# EAGLE design EEZ PSU post-regulator r4B44 (SS) (EAGLE 6.1)
Assembly variants: Farnell, TME
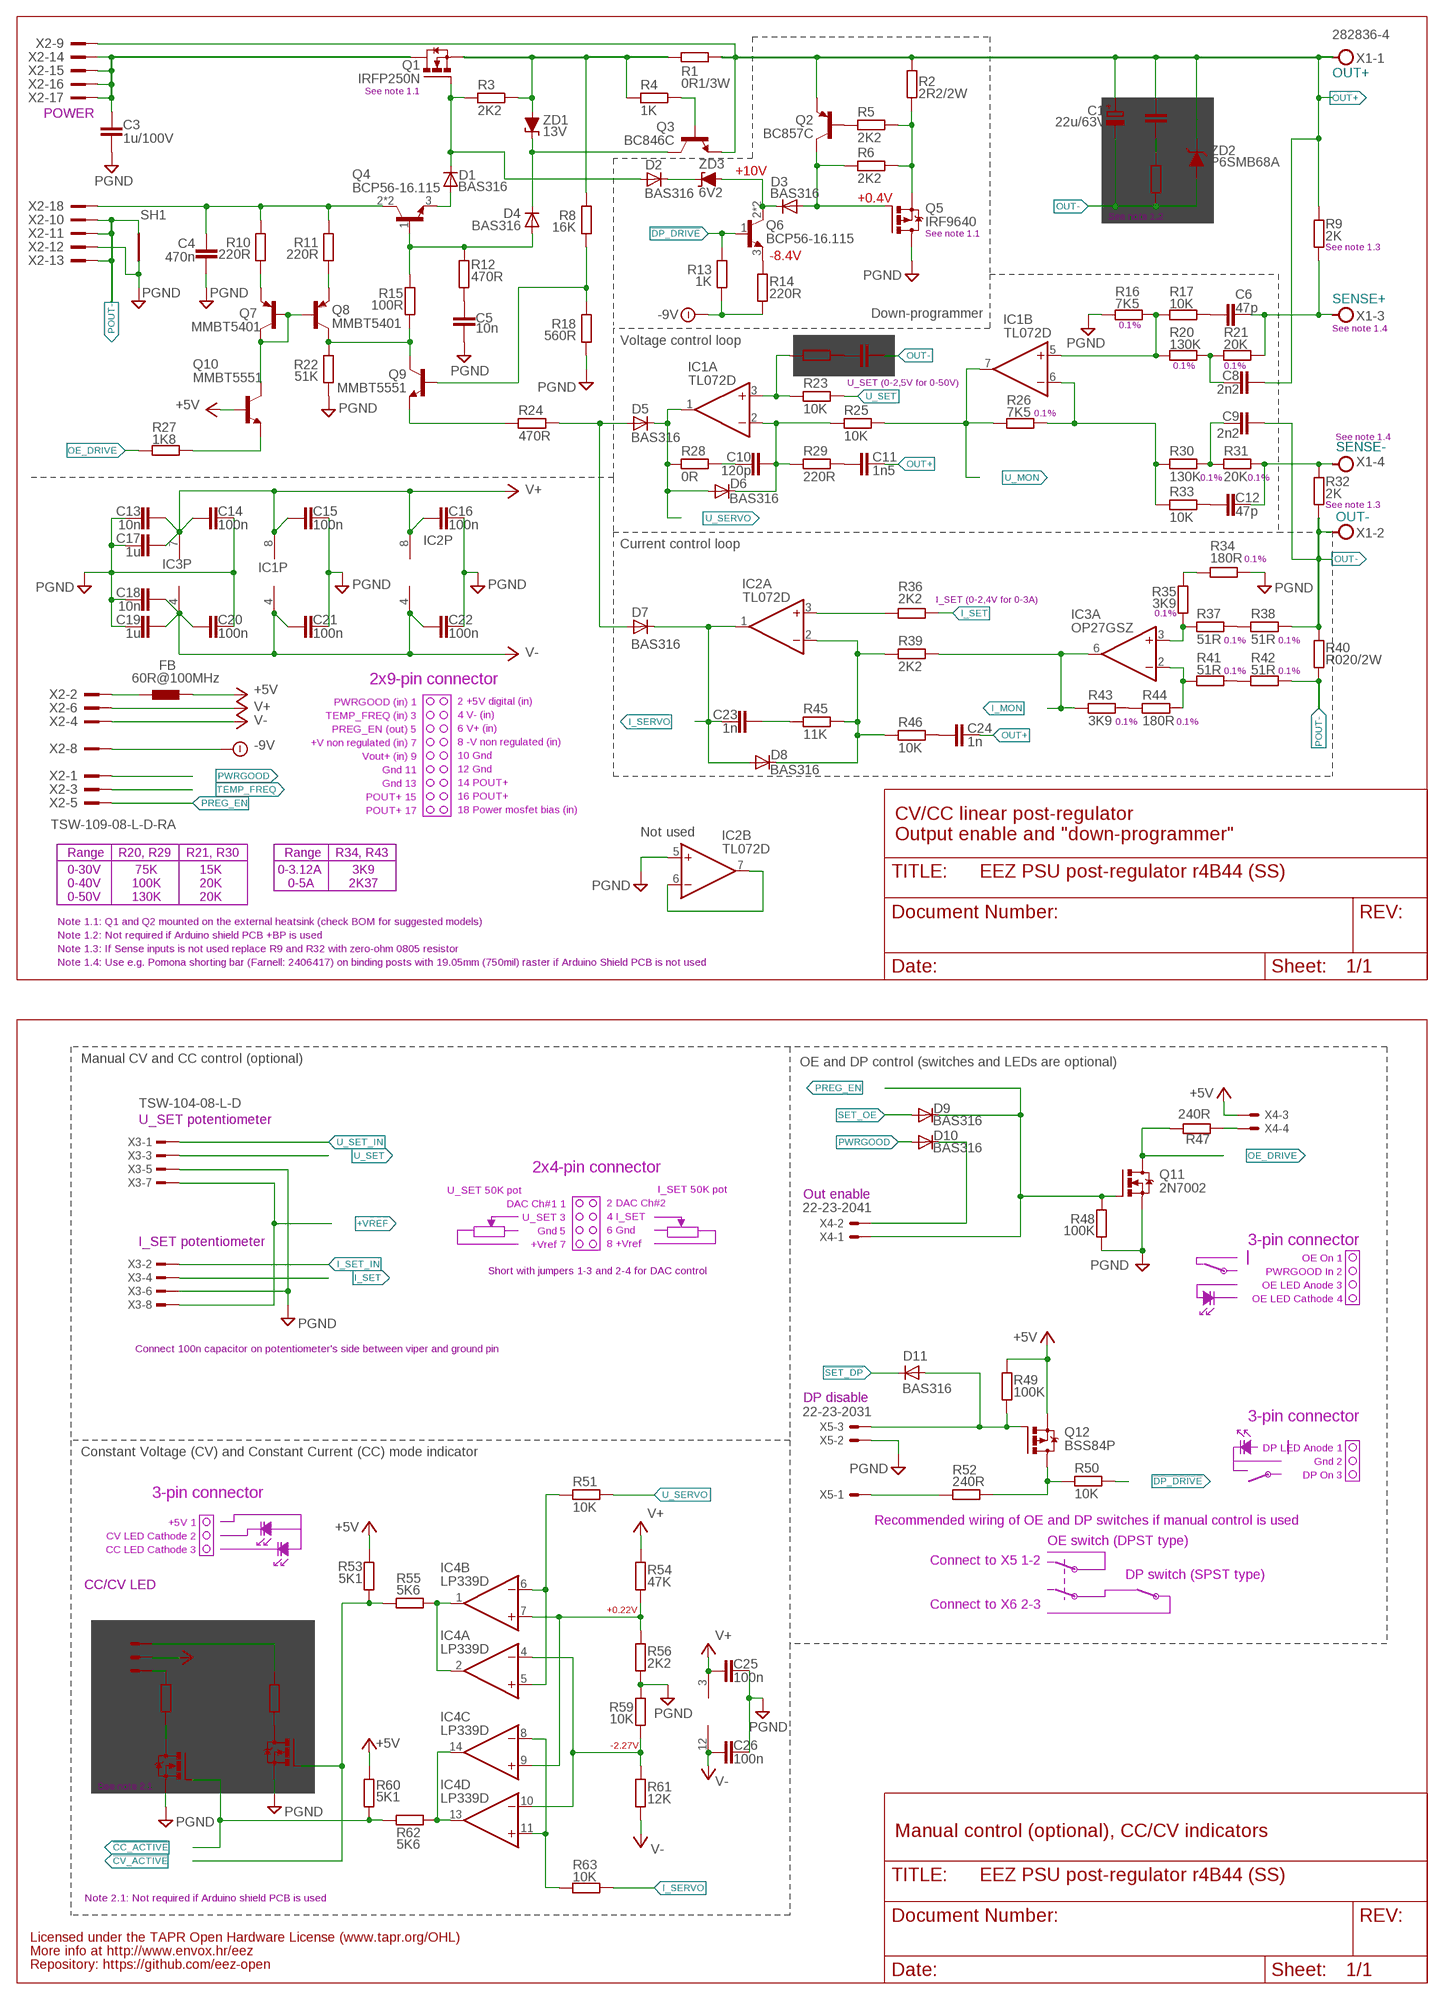
[diagram p0: schematic, sheet 1, part 1 of 2]
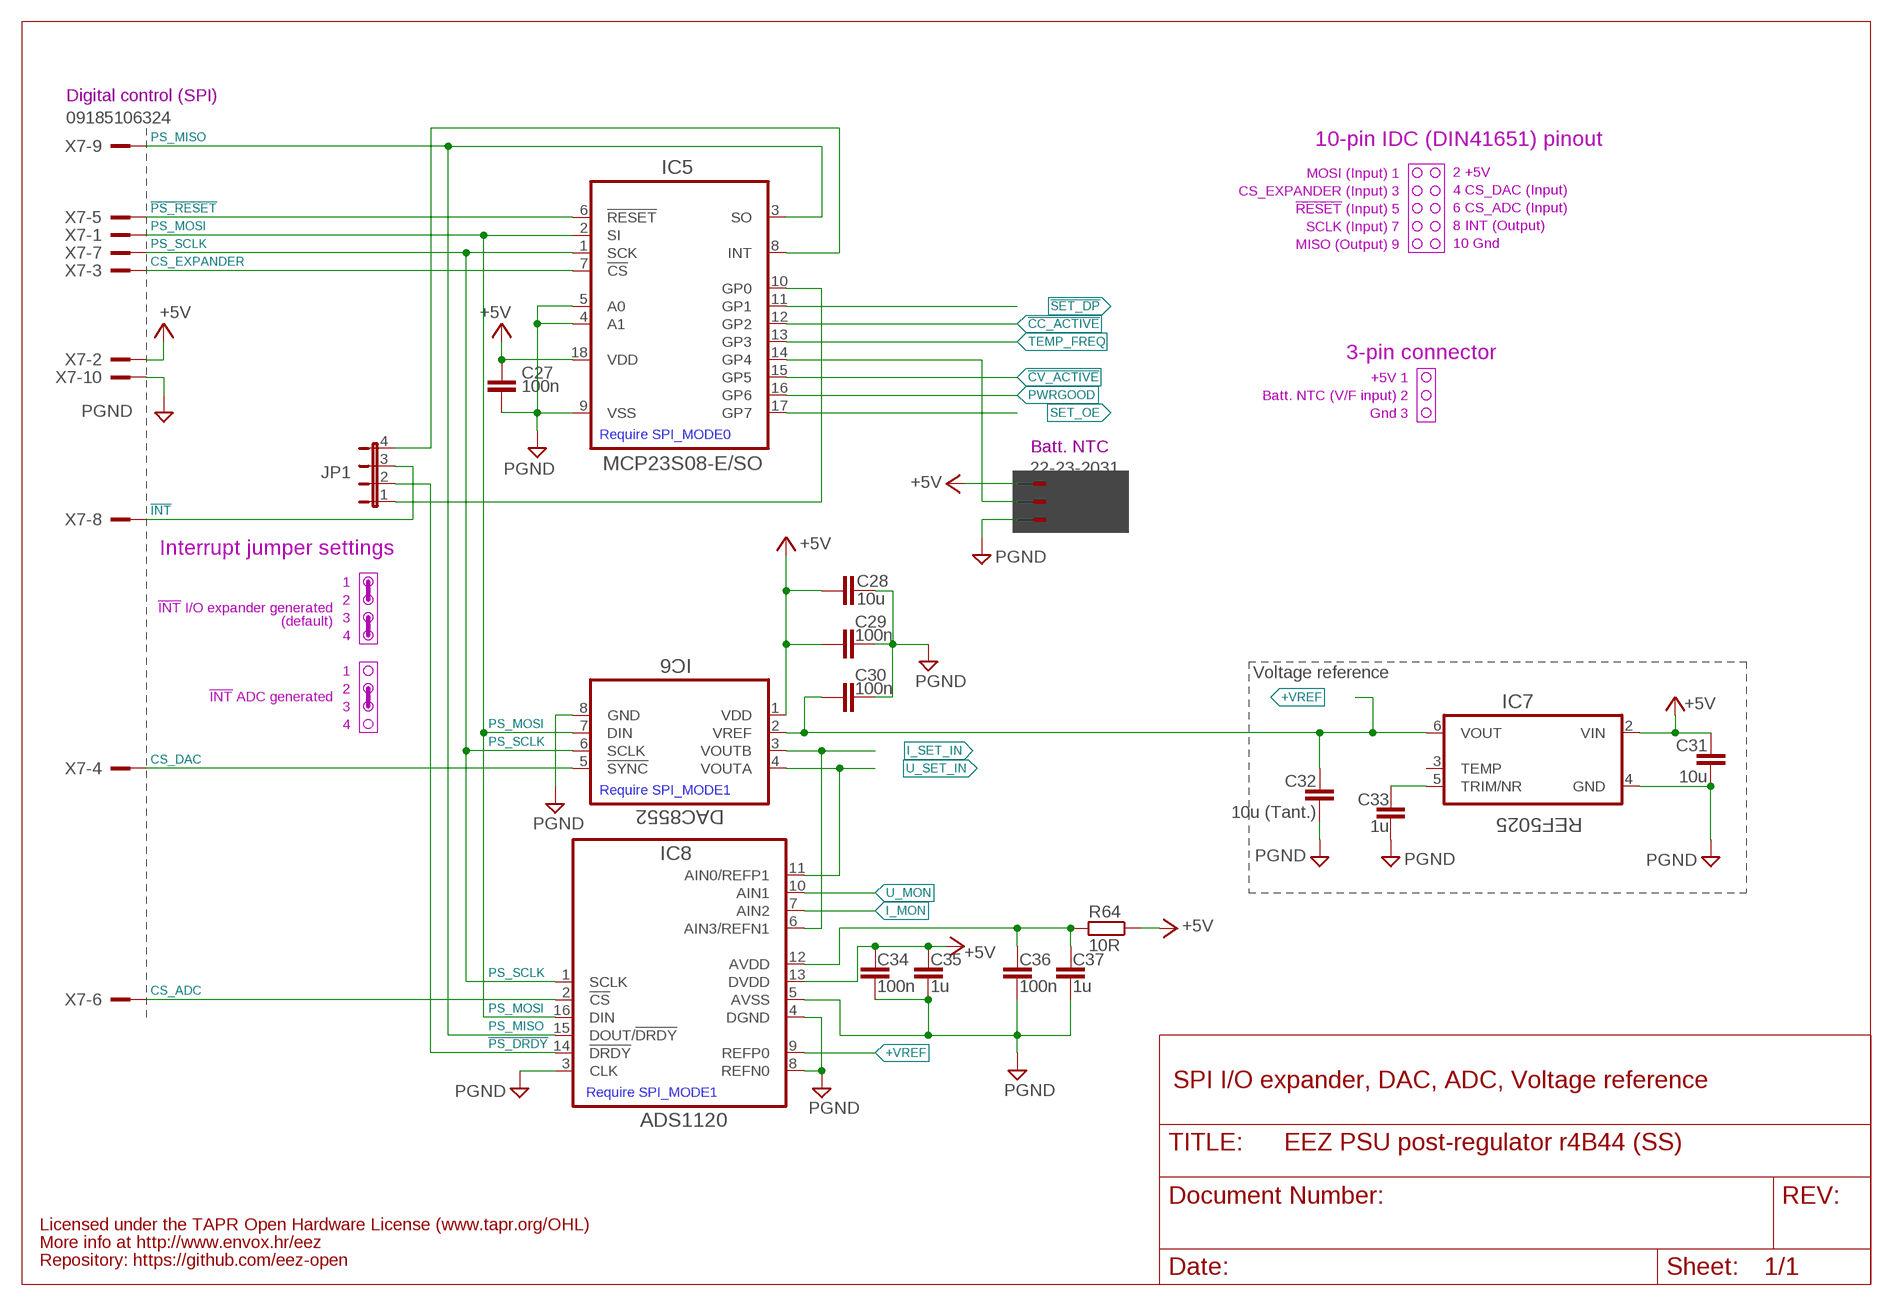
[diagram p1: schematic, sheet 1, part 2 of 2]

## Parts
C1  22u/63V  ECAPEEEFK+2.5MM  [CAPAE660X610N_COMBO2]
C2  470n  C-EUC1812  [C1812]
C3  1u/100V  C-EUC1206  [C1206]
C4  470n  C-EUC1812  [C1812]
C5  10n  C-EUC0805  [C0805]
C6  47p  C-EUC0805  [C0805]
C7  1n5  C-EUC0805  [C0805]
C8  2n2  C-EUC0805  [C0805]
C9  2n2  C-EUC0805  [C0805]
C10  120p  C-EUC0805  [C0805]
C11  1n5  C-EUC0805  [C0805]
C12  47p  C-EUC0805  [C0805]
C13  10n  C-EUC0805  [C0805]
C14  100n  C-EUC0603  [C0603]
C15  100n  C-EUC0603  [C0603]
C16  100n  C-EUC0603  [C0603]
C17  1u  C-EUC0805  [C0805]
C18  10n  C-EUC0805  [C0805]
C19  1u  C-EUC0805  [C0805]
C20  100n  C-EUC0603  [C0603]
C21  100n  C-EUC0603  [C0603]
C22  100n  C-EUC0603  [C0603]
C23  1n  C-EUC0805  [C0805]
C24  1n  C-EUC0805  [C0805]
C25  100n  C-EUC0603  [C0603]
C26  100n  C-EUC0603  [C0603]
C27  100n  C-EUC0603  [C0603]
C28  10u  C-EUC1206  [C1206]
C29  100n  C-EUC0603  [C0603]
C30  100n  C-EUC0603  [C0603]
C31  10u  C-EUC1206  [C1206]
C32  10u (Tant.)  C-EUC1206  [C1206]
C33  1u  C-EUC0805  [C0805]
C34  100n  C-EUC0603  [C0603]
C35  1u  C-EUC0805  [C0805]
C36  100n  C-EUC0603  [C0603]
C37  1u  C-EUC0805  [C0805]
D1  BAS316  DIODE-SOD323-W  [SOD323-W]
D2  BAS316  DIODE-SOD323-W  [SOD323-W]
D3  BAS316  DIODE-SOD323-W  [SOD323-W]
D4  BAS316  DIODE-SOD323-W  [SOD323-W]
D5  BAS316  DIODE-SOD323-W  [SOD323-W]
D6  BAS316  DIODE-SOD323-W  [SOD323-W]
D7  BAS316  DIODE-SOD323-W  [SOD323-W]
D8  BAS316  DIODE-SOD323-W  [SOD323-W]
D9  BAS316  DIODE-SOD323-W  [SOD323-W]
D10  BAS316  DIODE-SOD323-W  [SOD323-W]
D11  BAS316  DIODE-SOD323-W  [SOD323-W]
FB  60R@100MHz  FERRITE_BEAD0603  [BEAD0603]
IC1  TL072D  TL072SOIC8  [SOIC127P600X173-8N]
IC2  TL072D  TL072SOIC8  [SOIC127P600X173-8N]
IC3  OP27GSZ  OP27GSZSO8  [SOIC127P600X173-8N]
IC4  LP339D  LM339D  [SO14]
IC5  MCP23S08-E/SO  MCP23S08  [SOIC127P1030X265-18N]
IC6  DAC8552  DAC8552_DGK_8M  [DGK8-M]
IC7  REF5025  REF50XX  [SOIC127P600X175-8N]
IC8  ADS1120  ADS1120TSSOP-16  [PW(R-PDSO-G16)]
JP1  JP4E  [JP4]
Q1  IRFP250N  IRFP240  [TO247BV]
Q2  BC857C  BC857C-PNP-SOT23-BEC  [SOT23-BEC]
Q3  BC846C  BC846B-NPN-SOT23-BEC  [SOT23-BEC]
Q4  BCP56-16.115  BCP56  [SOT230P700X180-4N]
Q5  IRF9640  [TO220B-VMOS]
Q6  BCP56-16.115  BCP56  [SOT230P700X180-4N]
Q7  MMBT5401  BC857B-PNP-SOT23-BEC  [SOT23-BEC]
Q8  MMBT5401  BC857B-PNP-SOT23-BEC  [SOT23-BEC]
Q9  MMBT5551  MMBT5551LT1-NPN-SOT23-BEC  [SOT23-BEC]
Q10  MMBT5551  MMBT5551LT1-NPN-SOT23-BEC  [SOT23-BEC]
Q11  2N7002  [SOT103P240X110-3N]
Q12  BSS84P  IRLML2246TRPBF  [SOT95P237X112-3N]
Q13  2N7002  [SOT103P240X110-3N]
Q14  2N7002  [SOT103P240X110-3N]
R1  0R1/3W  R-EU_0411/3V  [0411V]
R2  2R2/2W  R-EU_0411/3V  [0411V]
R3  2K2  R-EU_R0805  [R0805]
R4  1K  R-EU_R0805  [R0805]
R5  2K2  R-EU_R0805  [R0805]
R6  2K2  R-EU_R0805  [R0805]
R7  1R  R-EU_R0805  [R0805]
R8  16K  R-EU_R0805  [R0805]
R9  2K  R-EU_R0805  [R0805]
R10  220R  R-EU_R0805  [R0805]
R11  220R  R-EU_R0805  [R0805]
R12  470R  R-EU_R0805  [R0805]
R13  1K  R-EU_R0805  [R0805]
R14  220R  R-EU_R0805  [R0805]
R15  100R  R-EU_R0805  [R0805]
R16  7K5  R-EU_R0805  [R0805]
R17  10K  R-EU_R0805  [R0805]
R18  560R  R-EU_R0805  [R0805]
R19  220R  R-EU_R0805  [R0805]
R20  130K  R-EU_R0805  [R0805]
R21  20K  R-EU_R0805  [R0805]
R22  51K  R-EU_R0805  [R0805]
R23  10K  R-EU_R0805  [R0805]
R24  470R  R-EU_R0805  [R0805]
R25  10K  R-EU_R0805  [R0805]
R26  7K5  R-EU_R0805  [R0805]
R27  1K8  R-EU_R0805  [R0805]
R28  0R  R-EU_R0805  [R0805]
R29  220R  R-EU_R0805  [R0805]
R30  130K  R-EU_R0805  [R0805]
R31  20K  R-EU_R0805  [R0805]
R32  2K  R-EU_R0805  [R0805]
R33  10K  R-EU_R0805  [R0805]
R34  180R  R-EU_R0805  [R0805]
R35  3K9  R-EU_R0805  [R0805]
R36  2K2  R-EU_R0805  [R0805]
R37  51R  R-EU_R0805  [R0805]
R38  51R  R-EU_R0805  [R0805]
R39  2K2  R-EU_R0805  [R0805]
R40  R020/2W  R-EU_R2512  [R2512]
R41  51R  R-EU_R0805  [R0805]
R42  51R  R-EU_R0805  [R0805]
R43  3K9  R-EU_R0805  [R0805]
R44  180R  R-EU_R0805  [R0805]
R45  11K  R-EU_R0805  [R0805]
R46  10K  R-EU_R0805  [R0805]
R47  240R  R-EU_R0805  [R0805]
R48  100K  R-EU_R0805  [R0805]
R49  100K  R-EU_R0805  [R0805]
R50  10K  R-EU_R0805  [R0805]
R51  10K  R-EU_R0805  [R0805]
R52  240R  R-EU_R0805  [R0805]
R53  5K1  R-EU_R0805  [R0805]
R54  47K  R-EU_R0805  [R0805]
R55  5K6  R-EU_R0805  [R0805]
R56  2K2  R-EU_R0805  [R0805]
R57  240R  R-EU_R0805  [R0805]
R58  240R  R-EU_R0805  [R0805]
R59  10K  R-EU_R0805  [R0805]
R60  5K1  R-EU_R0805  [R0805]
R61  12K  R-EU_R0805  [R0805]
R62  5K6  R-EU_R0805  [R0805]
R63  10K  R-EU_R0805  [R0805]
R64  10R  R-EU_R0805  [R0805]
SH1  GND  SHORT  [SHORT]
X1  282836-4  TBLOCK5.0_4A  [TBLOCK5.0_4]
X2  TSW-109-08-L-D-RA  [TSW-109-08-L-D-RA]
X3  TSW-104-08-L-D  TSW-104-02-S-D  [TSW-104-02-S-D]
X4  22-23-2041  [22-23-2041]
X5  22-23-2031  [22-23-2031]
X6  22-23-2031  [22-23-2031]
X7  09185106324  2510-  [PAK100/2500-10]
X8  22-23-2031  [22-23-2031]
ZD1  13V  ZENER-DIODEMINIMELF  [MINIMELF]
ZD2  P6SMB68A  [DO214AA]
ZD3  6V2  ZENER-DIODEMINIMELF  [MINIMELF]

## Nets
!CC_ACTIVE: IC5.12(GP2) Q14.1(G) R60.1 R62.2
!CV_ACTIVE: IC5.15(GP5) Q13.1(G) R53.1 R55.2
!DP_DRIVE: Q6.1(B) R13.1 R50.1
!INT: JP1.3 X7.8
!PS_DRDY: IC8.14(!DRDY) JP1.2
!PS_RESET: IC5.6(!RESET) X7.5
!SET_DP: D11.C IC5.11(GP1)
+5V: C27.1 C28.1 C29.2 C31.1 C34.2 C35.2 FB.P$2 IC5.18(VDD) IC6.1(VDD) IC7.2(VIN) IC8.13(DVDD) Q10.B Q12.2(S) R49.1 R53.2 R60.2 R64.1 X4.3 X6.2 X7.2 X8.1
+VREF: C30.2 C32.1 IC6.2(VREF) IC7.6(VOUT) IC8.9(REFP0) X3.7 X3.8
-9V: R13.2 R14.2 X2.8
BATT_NTC: IC5.14(GP4) X8.2
CC_LED: R57.2 X6.1
CS_ADC: IC8.2(!CS) X7.6
CS_DAC: IC6.5(!SYNC) X7.4
CS_EXPANDER: IC5.7(!CS) X7.3
CV_LED: R58.1 X6.3
DC_IN: C3.1 Q1.D X2.14 X2.15 X2.16 X2.17
DP_LED: Q12.3(D) R50.2 R52.2
GND [gnd]: C3.2 C4.2 C5.2 C13.1 C14.2 C15.1 C16.1 C17.1 C18.1 C19.1 C20.2 C21.1 C22.1 C25.1 C26.1 C27.2 C28.2 C29.1 C30.1 C31.2 C32.2 C33.2 C34.1 C35.1 C36.1 C37.1 IC2.5(B:+IN) IC5.4(A1) IC5.5(A0) IC5.9(VSS) IC6.8(GND) IC7.4(GND) IC8.3(CLK) IC8.4(DGND) IC8.5(AVSS) IC8.8(REFN0) Q5.D Q11.2(S) Q13.2(S) Q14.2(S) R16.1 R18.1 R22.1 R34.1 R48.1 R56.1 R59.2 SH1.1(GND_A) X2.12 X3.5 X3.6 X5.2 X7.10 X8.3 ; supply symbol labelled PGND
I_MON: IC3.6(A:OUT) IC8.7(AIN2) R39.1 R43.2
I_SERVO: C23.2 D7.C D8.A IC2.1(A:OUT) R63.1
I_SET: R36.1 X3.4
I_SET_IN: IC6.3(VOUTB) IC8.6(AIN3/REFN1) X3.2
INT_EXP: IC5.8(INT) JP1.4
ISENSE+: IC3.3(A:+IN) R35.2 R37.2
ISENSE-: IC3.2(A:-IN) R41.2 R44.1
N$1: Q6.3(E) R14.1
N$2: Q2.B R5.2
N$3: C6.2 R17.1
N$4: D10.C X4.2
N$5: R52.1 X5.1
N$6: D11.A Q12.1(G) R49.2 X5.3
N$7: Q13.3(D) R58.2
N$8: R37.1 R38.2
N$9: R47.1 X4.4
N$10: C12.2 R33.1
N$11: C33.1 IC7.5(TRIM/NR)
N$12: FB.P$1 X2.2
N$13: R41.1 R42.2
N$14: R43.1 R44.2
N$15: R34.2 R35.1
N$16: IC2.6(B:-IN) IC2.7(B:OUT)
N$17: C9.1 R30.2 R31.1
N$18: C10.2 R28.1
N$22: C24.2 R46.1
N$26: C7.2 R19.1
N$27: C11.2 R29.1
N$28: Q14.3(D) R57.1
N$29: IC1.3(A:+IN) R19.2 R23.2
N$32: C10.1 D6.C IC1.2(A:-IN) R25.2 R29.2
N$37: D8.C IC2.2(A:-IN) R39.2 R45.2 R46.2
N$42: C36.2 C37.2 IC8.12(AVDD) R64.2
N$44: Q9.B R8.1 R18.2
N$45: IC4.1(B:OUT) IC4.2(A:OUT) R55.1
N$48: IC4.13(D:OUT) IC4.14(C:OUT) R62.1
N$50: IC2.3(A:+IN) R36.2
N$54: D5.A D7.A R24.1
N$56: D1.C D2.A Q1.G R3.1
N$62: D1.A Q4.3(E)
N$63: IC5.10(GP0) JP1.1
N$65: D4.A Q4.1(B) R12.2 R15.1
N$67: C5.1 R12.1
N$117: C8.1 R20.2 R21.1
N$129: D4.C Q3.C ZD1.C
N$143: D2.C ZD3.C
N$145: Q9.E R24.2
N$146: Q5.S R2.1 R5.1 R6.1
N$147: D3.A Q2.C Q5.G R6.2
N$149: C2.2 R7.2
N$150: IC1.5(B:+IN) R16.2 R17.2 R20.1
N$153: IC4.5(A:+IN) IC4.6(B:-IN) R51.2
N$158: IC1.6(B:-IN) R26.2 R30.1 R33.2
N$161: IC4.8(C:-IN) IC4.11(D:+IN) R63.2
N$170: IC4.7(B:+IN) IC4.9(C:+IN) R54.1 R56.2
N$172: C23.1 R45.1
N$177: IC4.4(A:-IN) IC4.10(D:-IN) R59.1 R61.2
N$183: Q8.E R11.1
N$184: Q7.E R10.1
N$186: Q10.E R27.2
N$201: Q3.B R4.1
OE_DRIVE: Q11.3(D) R27.1 R47.2
OUT+: C1.1(+) C1.1.1(+) C2.1 C8.2 C11.1 C24.1 Q2.E Q3.E R1.1 R2.2 R9.1 X1.P$1 X2.9 ZD2.C
OUT-: C1.2(-) C1.2.1(-) C7.1 C9.2 R7.1 R32.2 R38.1 R40.1 X1.P$2 ZD2.A
POUT-: R40.2 R42.1 SH1.2(GND_B) X2.10 X2.11 X2.13
PREG_EN: D9.C Q11.1(G) R48.2 X2.5 X4.1
PS_MISO: IC5.3(SO) IC8.15(DOUT/!DRDY) X7.9
PS_MOSI: IC5.2(SI) IC6.7(DIN) IC8.16(DIN) X7.1
PS_SCLK: IC5.1(SCK) IC6.6(SCLK) IC8.1(SCLK) X7.7
PWRGOOD: D10.A IC5.16(GP6) X2.1
Q4_OUT: Q1.S R1.2 R3.2 R4.2 R8.2 ZD1.A
Q6C: D3.C Q6.2(C) Q6.4(C) ZD3.A
Q7C: Q7.B Q7.C Q8.B Q10.C
Q8C: Q8.C Q9.C R15.2 R22.2
SENSE+: C6.1 R9.2 R21.2 X1.P$3
SENSE-: C12.1 R31.2 R32.1 X1.P$4
SET_OE: D9.A IC5.17(GP7)
TEMP_FREQ: IC5.13(GP3) X2.3
U_MON: IC1.7(B:OUT) IC8.10(AIN1) R25.1 R26.1
U_SERVO: D5.C D6.A IC1.1(A:OUT) R28.2 R51.1
U_SET: R23.1 X3.3
U_SET_IN: IC6.4(VOUTA) IC8.11(AIN0/REFP1) X3.1
V+: C13.2 C14.1 C15.2 C16.2 C17.2 C25.2 IC1.8(P:V+) IC2.8(P:V+) IC3.7(P:V+) IC4.3(P:V+) R54.2 X2.6
V-: C18.2 C19.2 C20.1 C21.2 C22.2 C26.2 IC1.4(P:V-) IC2.4(P:V-) IC3.4(P:V-) IC4.12(P:GND) R61.1 X2.4
VBIAS: C4.1 Q4.2(C) Q4.4(C) R10.2 R11.2 X2.18
Unconnected: IC7.3(TEMP) X2.7

## Notes on the sheet
- See note 1.1
- POWER
- +10V
- +0.4V
- See note 1.2
- See note 1.1
- See note 1.3
- -8.4V
- Down-programmer
- 0.1%
- See note 1.4
- Voltage control loop
- 0.1% | 0.1%
- U_SET (0-2,5V for 0-50V)
- 0.1%
- See note 1.4
- 0.1% | 0.1%
- See note 1.3
- Current control loop
- 0.1%
- I_SET (0-2,4V for 0-3A)
- 0.1%
- 0.1% | 0.1%
- 0.1% | 0.1%
- 2x9-pin connector
- PWRGOOD (in) 1
- 2 +5V digital (in)
- TEMP_FREQ (in) 3
- 4 V- (in)
- PREG_EN (out) 5 | 0.1% | 0.1%
- 6 V+ (in)
- +V non regulated (in) 7
- 8 -V non regulated (in)
- Vout+ (in) 9
- 10 Gnd
- Gnd 11
- 12 Gnd
- Gnd 13
- 14 POUT+
- POUT+ 15
- 16 POUT+
- POUT+ 17
- 18 Power mosfet bias (in)
- CV/CC linear post-regulator
- Not used | Output enable and "down-programmer"
- Range | R20, R29 | R21, R30 | Range | R34, R43
- 0-30V | 75K | 15K | 0-3.12A | 3K9
- 0-40V | 100K | 20K | 0-5A | 2K37
- 0-50V | 130K | 20K
- Note 1.1: Q1 and Q2 mounted on the external heatsink (check BOM for suggested models)
- Note 1.2: Not required if Arduino shield PCB +BP is used
- Note 1.3: If Sense inputs is not used replace R9 and R32 with zero-ohm 0805 resistor
- Note 1.4: Use e.g. Pomona shorting bar (Farnell: 2406417) on binding posts with 19.05mm (750mil) raster if Arduino Shield PCB is not used
- Manual CV and CC control (optional) | OE and DP control (switches and LEDs are optional)
- U_SET potentiometer
- 2x4-pin connector
- U_SET 50K pot
- Out enable
- I_SET 50K pot
- DAC Ch#1 1
- 2 DAC Ch#2
- U_SET 3
- 4 I_SET
- Gnd 5
- 6 Gnd | 3-pin connector
- I_SET potentiometer
- +Vref 7
- 8 +Vref
- OE On 1
- PWRGOOD In 2
- Short with jumpers 1-3 and 2-4 for DAC control
- OE LED Anode 3
- OE LED Cathode 4
- Connect 100n capacitor on potentiometer's side between viper and ground pin
- DP disable
- 3-pin connector
- DP LED Anode 1
- Constant Voltage (CV) and Constant Current (CC) mode indicator
- Gnd 2
- DP On 3
- 3-pin connector
- +5V 1
- Recommended wiring of OE and DP switches if manual control is used
- CV LED Cathode 2
- CC LED Cathode 3 | OE switch (DPST type)
- Connect to X5 1-2
- DP switch (SPST type)
- CC/CV LED
- Connect to X6 2-3
- +0.22V
- -2.27V
- See note 2.1
- Manual control (optional), CC/CV indicators
- Note 2.1: Not required if Arduino shield PCB is used
- Licensed under the TAPR Open Hardware License (www.tapr.org/OHL)
- More info at http://www.envox.hr/eez
- Repository: https://github.com/eez-open
- Digital control (SPI)
- 10-pin IDC (DIN41651) pinout
- MOSI (Input) 1
- 2 +5V
- CS_EXPANDER (Input) 3
- 4 CS_DAC (Input)
- !RESET! (Input) 5
- 6 CS_ADC (Input)
- SCLK (Input) 7
- 8 INT (Output)
- MISO (Output) 9
- 10 Gnd
- 3-pin connector
- +5V 1
- Batt. NTC (V/F input) 2
- Gnd 3
- Require SPI_MODE0
- Batt. NTC
- Interrupt jumper settings
- 1
- 2
- !INT! I/O expander generated | 3
- (default)
- 4
- 1 | Voltage reference
- 2
- !INT! ADC generated | 3
- 4
- Require SPI_MODE1
- SPI I/O expander, DAC, ADC, Voltage reference
- Require SPI_MODE1
- Licensed under the TAPR Open Hardware License (www.tapr.org/OHL)
- More info at http://www.envox.hr/eez
- Repository: https://github.com/eez-open

## Library data of the parts
C1 = EEZ_Lib1:ECAP
C2-C37 = rcl:C-EU: CAPACITOR, European symbol
D1-D11 = diode:DIODE-: DIODE
FB = EEZ_Lib1:FERRITE_BEAD: FAIR-RITE - 2506033007Y3 - FERRITE BEAD, 0.04OHM, 3A, 0603 Farnell: 2112873
IC1 IC2 = EEZ_Lib1:TL072
IC3 = EEZ_Lib1:OP27GSZ: Low Noise, Precision Operational Amplifier
IC4 = linear:LM339: Low Power Low Offset Voltage Quad Comparators with open collector; LM139/LM239/LM339/LM2901/LM3302
IC5 = EEZ_Lib1:MCP23S08: 8-Bit I/O Expander with SPI; DESCRIPTION: IC I/O EXPANDER; MPN: MCP23S08-E/SO; OC_FARNELL: 1332092; OC_NEWARK: 08J8733; PACKAGE: SOIC-18; SUPPLIER: Microchip
IC6 = EEZ_Lib1:DAC8552_DGK_8
IC7 = EEZ_Lib1:REF50XX: Low-Noise (3μVpp/V), Very Low Drift (max. 8ppm/°C), Precision Voltage Reference Pin compatible with REF2 Farnell: 1439628
IC8 = EEZ_Lib1:ADS1120: Low-Power, Low-Noise, 16-Bit, Analog-to-Digital Converter for Small-Signal Sensors Farnell: 2402249
JP1 = jumper:JP4E: JUMPER
Q1 = EEZ_Lib1:IRFP240: HEXFET Power MosFet Source: http://www.irf.com/
Q2 Q7 Q8 = transistor:*-PNP-: PNP Transistror
Q3 Q9 Q10 = transistor:*-NPN-: NPN Transistror BF959 corrected 2008.03.06
Q4 Q6 = EEZ_Lib1:BCP56: Low power NPN Transistor, Vceo=80V, Ic=1A, SOT-223
Q5 = EEZ_Lib1:IRF9640: P-ch MOSFET, 11 A, 200 V, 500 mohm, -10 V, -4 V; FARNELL: 8648654; TME: IRF9640PBF
Q11 Q13 Q14 = EEZ_Lib1:2N7002: N-CHANNEL ENHANCEMENT MODE FIELD EFFECT TRANSISTOR; MPN: 2N7002-7-F; OC_FARNELL: 1713823; OC_NEWARK: 25R5679; PACKAGE: SOT-23-3; SUPPLIER: DIODES INC.
Q12 = EEZ_Lib1:IRLML2246TRPBF: HEXFET Power MOSFET (-20V, -2.6A); MPN: IRLML2246TRPBF; OC_FARNELL: 1888166; OC_NEWARK: 40T7450; PACKAGE: SOT-3; SUPPLIER: International Rectifier; TME: IRLML2246TRPBF
R1-R64 = rcl:R-EU_: RESISTOR, European symbol
SH1 = EEZ_Lib1:SHORT
X1 = EEZ_Lib1:TBLOCK5.0_4A
X2 = EEZ_Lib1:TSW-109-08-L-D-RA: Samtec TSW-109-08-L-D-RA Header, 2.54MM, THT, R/A, 18-way; FARNELL: 2032801
X3 = EEZ_Lib1:TSW-104-02-S-D: THROUGH-HOLE .025" SQ POST HEADER Source: Samtec TSW.pdf
X4 = con-molex:22-23-2041: .100" (2.54mm) Center Header - 4 Pin; MF: MOLEX; MPN: 22-23-2041; OC_FARNELL: 1462920; OC_NEWARK: 38C0355
X5 X6 X8 = con-molex:22-23-2031: .100" (2.54mm) Center Header - 3 Pin; MF: MOLEX; MPN: 22-23-2031; OC_FARNELL: 1462950; OC_NEWARK: 30C0862
X7 = con-3m:2510-: 3M (TM) Pak 100 4-Wall Header Source: 3M; MF: 3M; MPN: 2510-6002UB; OC_FARNELL: 9838244; OC_NEWARK: 46F4725
ZD1 ZD3 = EEZ_Lib1:ZENER-DIODE
ZD2 = EEZ_Lib1:P6SMB68A: Transient Voltage Suppression Diodes, DO-214AA

## Net classes
0 default: width 0.254 mm, drill 0.61 mm, clearance 0.254 mm
1 dgnd: width 0.254 mm, drill 0.61 mm, clearance 0.254 mm
2 gnd: width 0.254 mm, drill 0.61 mm, clearance 0.254 mm

## Board
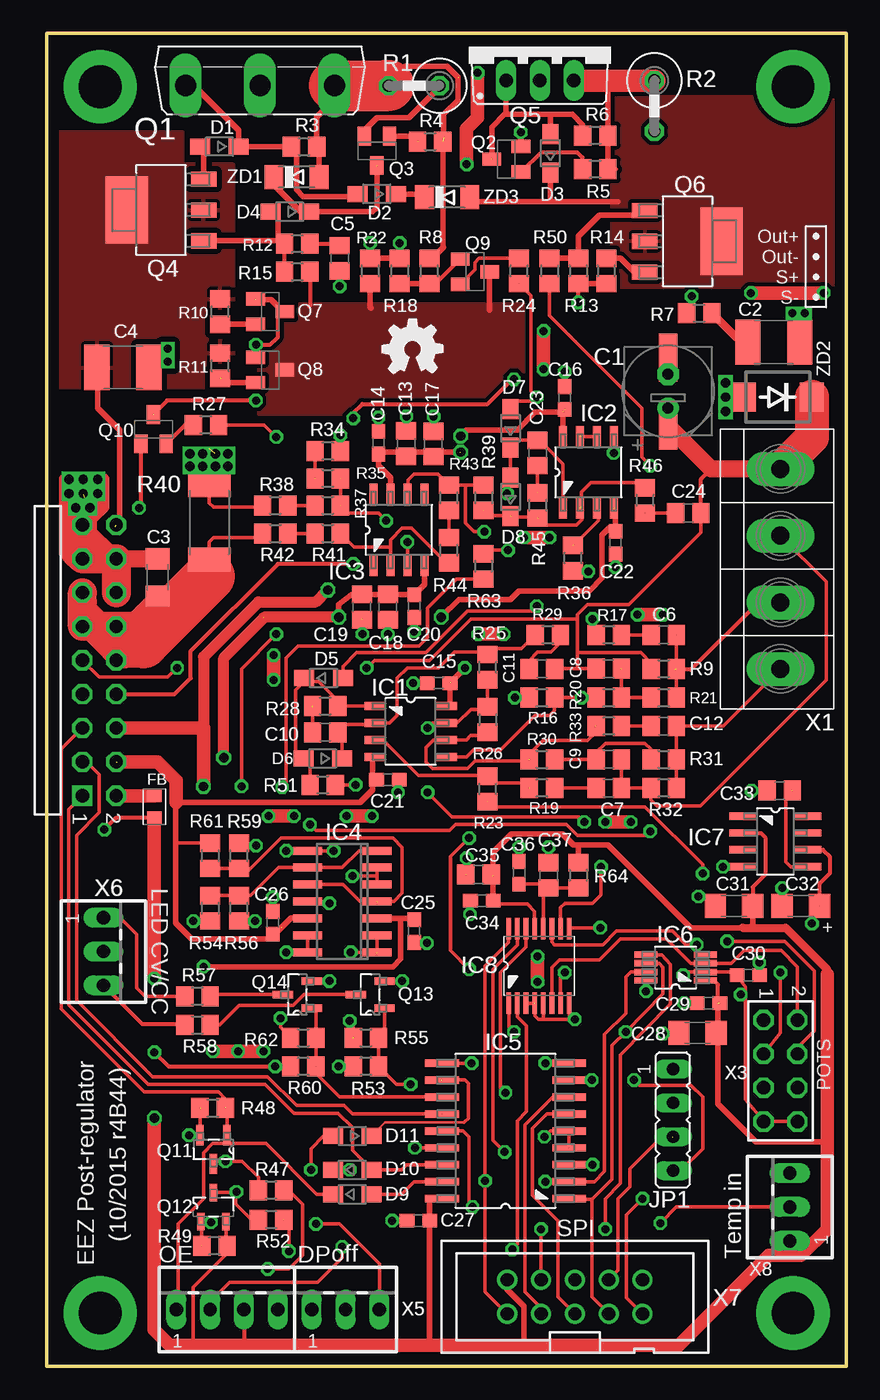
[diagram p2: board, top side]
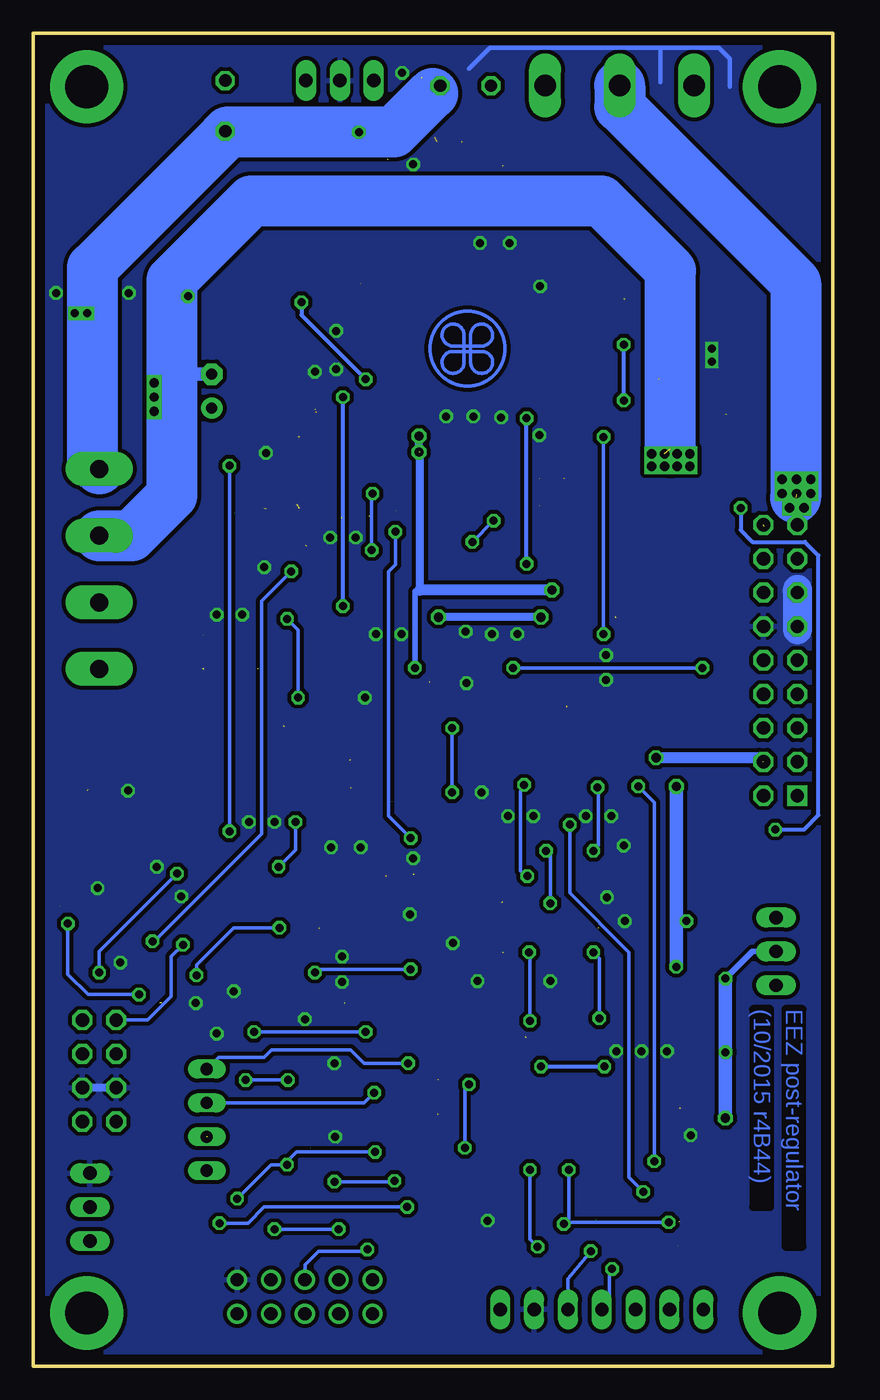
[diagram p3: board, bottom side, seen from below]

Size 60 x 100 mm. Coordinates in mm from the lower left corner, seen from the top.
Outline: 60,0 60,100 0,100 0,0 60,0
Copper layers (1+5*16): Top 0.035mm / dielectric 0.75mm / Route5 0.035mm / dielectric 0.75mm / Bottom 0.035mm
Design rules: minimum track width 10mil, minimum drill 0.5mm, track to track 8mil, track to pad 8mil, pad to pad 8mil, via to via 8mil, smd to smd 8mil, copper to edge 30mil, drill to drill 8mil, minimum pad ring 10mil, minimum via ring 8mil, stop-mask expansion 0mil, vias tented up to drill 25mil, thermal gap 10mil
tKeepout: 4 lines

### Footprints (pad centres in the part's own frame; a part is rotated, then mirrored left to right if it is on the bottom)
CAPAE660X610N_COMBO2 = smd 3.6 x 1.4: 1 -2.6,0; 2 2.5,0 | drill 0.813 pad 1.6: 1.1 -1.27,0 | drill 0.813 pad 1.6 octagon: 2.1 1.27,0
C1812 = smd 1.9 x 3.4: 1 -1.95,0; 2 1.95,0
C1206 = smd 1.6 x 1.8: 1 -1.4,0; 2 1.4,0
C0805 = smd 1.3 x 1.5: 1 -0.95,0; 2 0.95,0
C0603 = smd 1.1 x 1: 1 -0.85,0; 2 0.85,0
SOD323-W = smd 1.5 x 1.2: A 1.45,0; C -1.45,0
BEAD0603 = smd 1 x 1.1: P$1 -0.85,0; P$2 0.85,0
SOIC127P600X173-8N = smd 1.55 x 0.6: 1 -2.7,1.9; 2 -2.7,0.63; 3 -2.7,-0.64; 4 -2.7,-1.91; 5 2.7,-1.91; 6 2.7,-0.64; 7 2.7,0.63; 8 2.7,1.9
SO14 = smd 0.6 x 2.2: 1 -3.81,-2.6; 2 -2.54,-2.6; 3 -1.27,-2.6; 4 0,-2.6; 5 1.27,-2.6; 6 2.54,-2.6; 7 3.81,-2.6; 8 3.81,2.6; 9 2.54,2.6; 10 1.27,2.6; 11 0,2.6; 12 -1.27,2.6; 13 -2.54,2.6; 14 -3.81,2.6
SOIC127P1030X265-18N = smd 2.54 x 0.559: 1 -4.775,5.08; 2 -4.775,3.81; 3 -4.775,2.54; 4 -4.775,1.27; 5 -4.775,0; 6 -4.775,-1.27; 7 -4.775,-2.54; 8 -4.775,-3.81; 9 -4.775,-5.08; 10 4.775,-5.08; 11 4.775,-3.81; 12 4.775,-2.54; 13 4.775,-1.27; 14 4.775,0; 15 4.775,1.27; 16 4.775,2.54; 17 4.775,3.81; 18 4.775,5.08
DGK8-M = smd 1.727 x 0.483: 1 -2.235,0.965; 2 -2.235,0.33; 3 -2.235,-0.33; 4 -2.235,-0.965; 5 2.235,-0.965; 6 2.235,-0.33; 7 2.235,0.33; 8 2.235,0.965
SOIC127P600X175-8N = smd 1.981 x 0.559: 1 -2.464,1.905; 2 -2.464,0.635; 3 -2.464,-0.635; 4 -2.464,-1.905; 5 2.464,-1.905; 6 2.464,-0.635; 7 2.464,0.635; 8 2.464,1.905
PW(R-PDSO-G16) = smd 1.6 x 0.35: 1 -2.8,2.3; 2 -2.8,1.65; 3 -2.8,1; 4 -2.8,0.35; 5 -2.8,-0.3; 6 -2.8,-0.95; 7 -2.8,-1.6; 8 -2.8,-2.25; 9 2.8,-2.25; 10 2.8,-1.6; 11 2.8,-0.95; 12 2.8,-0.3; 13 2.8,0.35; 14 2.8,1; 15 2.8,1.65; 16 2.8,2.3
JP4 = drill 0.914 long: 1 -3.81,0; 2 -1.27,0; 3 1.27,0; 4 3.81,0
TO247BV = drill 1.6 long: D 0,-2.921; G -5.588,-2.921; S 5.588,-2.921
SOT23-BEC = smd 1 x 1.4: B -0.95,-1.1; C 0,1.1; E 0.95,-1.1
SOT230P700X180-4N = smd 1.905 x 1.143: 1 -3.2,2.311; 2 -3.2,0; 3 -3.2,-2.311 | smd 3.175 x 5.08: 4 2.565,0
TO220B-VMOS = drill 1.016 long: D 0,-2.54; G -2.54,-2.54; S 2.54,-2.54
SOT103P240X110-3N = smd 1.524 x 0.559: 1 -1.079,1.016; 2 -1.079,-1.016; 3 1.079,0
SOT95P237X112-3N = smd 1.321 x 0.559: 1 -1.092,0.94; 2 -1.092,-0.94; 3 1.092,0
0411V = drill 0.914 octagon: 1 -2.54,0; 2 1.27,0
R0805 = smd 1.3 x 1.5: 1 -0.95,0; 2 0.95,0
R2512 = smd 1.8 x 3.2: 1 -2.8,0; 2 2.8,0
SHORT = drill 0.6 octagon: 1 0,0; 2 0,0
TBLOCK5.0_4 = drill 1.35 pad 2.54 long: P$1 0,0; P$2 0,-5; P$3 0,-10; P$4 0,-15
TSW-109-08-L-D-RA = drill 1 pad 1.5 square: 1 10.16,1.524 | drill 1 pad 1.5 octagon: 2 10.16,4.064; 3 7.62,1.524; 4 7.62,4.064; 5 5.08,1.524; 6 5.08,4.064; 7 2.54,1.524; 8 2.54,4.064; 9 0,1.524; 10 0,4.064; 11 -2.54,1.524; 12 -2.54,4.064; 13 -5.08,1.524; 14 -5.08,4.064; 15 -7.62,1.524; 16 -7.62,4.064; 17 -10.16,1.524; 18 -10.16,4.064
TSW-104-02-S-D = drill 1 pad 1.5 octagon: 1 -3.81,-1.27; 2 -3.81,1.27; 3 -1.27,-1.27; 4 -1.27,1.27; 5 1.27,-1.27; 6 1.27,1.27; 7 3.81,-1.27; 8 3.81,1.27
22-23-2041 = drill 1 long: 1 -3.81,0; 2 -1.27,0; 3 1.27,0; 4 3.81,0
22-23-2031 = drill 1 long: 1 -2.54,0; 2 0,0; 3 2.54,0
PAK100/2500-10 = drill 1 pad 1.422: 1 -5.08,-1.27; 2 -5.08,1.27; 3 -2.54,-1.27; 4 -2.54,1.27; 5 0,-1.27; 6 0,1.27; 7 2.54,-1.27; 8 2.54,1.27; 9 5.08,-1.27; 10 5.08,1.27
MINIMELF = smd 1.4 x 1.8: A 1.7,0; C -1.7,0
DO214AA = smd 1.8 x 2.2: A 2.55,0; C -2.55,0

### Placement (x,y rotation side)
C1  46.61,73.15 90 top
C2  54.55,76.83 180 top
C3  8.32,59.18 270 top
C4  5.71,74.93 0 top
C5  21.97,83.12 270 top
C6  46.29,54.86 180 top
C7  42.16,43.37 180 top
C8  42.16,52.33 180 top
C9  42.16,45.53 0 top
C10  20.89,47.56 180 top
C11  37.15,52.32 180 top
C12  46.29,48.02 180 top
C13  26.96,69.22 270 top
C14  24.89,69.28 90 top
C15  29.4,51.24 0 top
C16  38.86,72.64 270 top
C17  29,69.2 270 top
C18  25.59,56.96 90 top
C19  23.64,56.96 90 top
C20  27.56,57.02 270 top
C21  25.59,44.01 180 top
C22  42.67,61.79 90 top
C23  36.83,68.52 90 top
C24  48.13,64.01 180 top
C25  27.56,32.64 90 top
C26  16.95,33.27 270 top
C27  27.88,10.92 180 top
C28  48.83,25.02 180 top
C29  49.66,27.24 0 top
C30  52.64,29.34 180 top
C31  51.56,34.54 180 top
C32  56.58,34.54 180 top
C33  54.99,43.18 180 top
C34  32.64,34.92 0 top
C35  32.38,36.89 0 top
C36  35.43,37.02 270 top
C37  37.66,36.83 270 top
D1  12.95,91.5 180 top
D2  24.77,87.95 180 top
D3  37.78,91 90 top
D4  18.22,86.61 180 top
D5  20.76,51.63 0 top
D6  20.7,45.59 180 top
D7  34.8,70.36 90 top
D8  34.8,65.21 90 top
D9  22.92,12.89 0 top
D10  22.92,14.73 0 top
D11  22.92,17.27 180 top
EEZ_SIGNATURE  SIGNATURESMALL  [SIGNATURE_5MM]  27.43,76.34 180 top
FB  8.06,41.97 270 top
IC1  27.3,47.62 0 top
IC2  40.64,67.06 90 top
IC3  26.42,62.74 90 top
IC4  22.16,34.86 90 top
IC5  34.42,17.65 180 top
IC6  47.18,29.91 180 top
IC7  54.67,39.37 0 top
IC8  36.96,30.04 90 top
JP1  46.99,18.48 270 top
Q1  16,99 0 top
Q2  34.48,90.55 90 top
Q3  24.77,91.19 180 top
Q4  8.57,86.74 180 top
Q5  37,99 0 top
Q6  48.07,84.39 0 top
Q7  16.76,79.12 270 top
Q8  16.76,74.74 270 top
Q9  32.13,82.11 270 top
Q10  8,70.29 0 top
Q11  12.51,16.26 270 top
Q12  12.51,11.94 90 top
Q13  24.26,27.88 180 top
Q14  18.8,27.88 180 top
R1  26.92,96.08 180 top
R2  45.59,93.92 270 top
R3  19.3,91.5 0 top
R4  28.77,91.88 0 top
R5  41.15,89.79 180 top
R6  41.15,92.33 180 top
R7  48.96,78.99 0 top
R8  28.7,82.17 90 top
R9  46.29,52.32 0 top
R10  13.02,79.12 90 top
R11  13.02,75.06 90 top
R12  18.8,84.2 180 top
R13  39.88,82.17 270 top
R14  41.97,82.17 270 top
R15  18.8,82.11 0 top
R16  37.15,50.16 0 top
R17  42.16,54.86 180 top
R18  26.48,82.17 270 top
R19  37.15,43.37 180 top
R20  42.16,50.16 0 top
R21  46.29,50.16 0 top
R22  24.26,82.17 270 top
R23  33.08,43.31 90 top
R24  35.43,82.17 90 top
R25  33.08,52.44 90 top
R26  33.08,48.51 270 top
R27  11.94,70.61 180 top
R28  20.89,49.53 0 top
R29  37.59,54.86 180 top
R30  37.15,45.53 0 top
R31  46.29,45.53 0 top
R32  46.29,43.37 180 top
R33  42.16,48.02 180 top
R34  21.08,68.64 180 top
R35  21.08,66.61 0 top
R36  39.48,60.63 90 top
R37  21.08,64.58 0 top
R38  17.14,64.58 0 top
R39  32.77,65.16 270 top
R40  12.19,63.31 270 top
R41  21.08,62.48 0 top
R42  17.14,62.48 0 top
R43  30.16,65.15 90 top
R44  30.16,61.21 90 top
R45  36.83,64.58 270 top
R46  44.89,64.96 90 top
R47  16.83,13.21 180 top
R48  12.45,19.37 0 top
R49  12.57,9.02 180 top
R50  37.72,82.17 270 top
R51  20.7,43.62 0 top
R52  16.83,10.99 180 top
R53  23.94,22.48 180 top
R54  12.26,34.35 270 top
R55  23.94,24.64 0 top
R56  14.41,34.35 90 top
R57  11.3,27.75 180 top
R58  11.3,25.59 0 top
R59  14.41,38.29 90 top
R60  19.24,22.48 180 top
R61  12.26,38.29 270 top
R62  19.24,24.64 0 top
R63  32.77,60.01 270 top
R64  39.88,36.83 270 top
SH1  2.67,58.04 0 top
X1  55.05,67.31 0 top
X2  1.14,52.96 270 top
X3  55.05,22.16 270 top
X4  13.53,4.25 0 top
X5  22.42,4.25 0 top
X6  4.25,31.11 270 top
X7  39.62,5.21 0 top
X8  55.75,11.94 90 top
ZD1  18.73,89.22 0 top
ZD2  54.86,72.71 180 top
ZD3  30.04,87.69 0 top

### Tracks (layer width: path | path; a pad name or v marks a point on that pad's centre or on a via)
!CC_ACTIVE  (1 unrouted)
  Top 0.254: R60.1 R62.2 20.19,26.86 Q14.1 19.43,26.86 | 20.19,21.84 20.19,21.97 | 20.19,21.97 R60.1 | IC5.12 21.97,20.19 20.19,21.97
!CV_ACTIVE  (via drill 0.6)
  Top 0.254: Q13.1 25.34,25.09 R55.2 R53.1 26.22,21.14 v27.3,21.14 | IC5.15 v27.62,16.38
  Bottom 0.254: v27.62,16.38 27.62,20.83 v27.3,21.14
!DP_DRIVE
  Top 0.406: R50.1 R13.1 39.88,84.77 41.47,86.36 44.9,86.36 44.87,86.39 Q6.1
!INT  (1 unrouted)
  Top 0.254: 46.93,17.21 46.16,17.21 43.75,14.8 43.75,13.46 42.86,12.57 42.86,7.18 X7.8
!PS_DRDY  (via drill 0.6)
  Top 0.254: IC8.14 35.96,31.45 34.04,29.53 34.04,20.89 v34.42,20.51
  Bottom 0.254: JP1.2 35.18,19.75 v34.42,20.51
!PS_RESET
  Top 0.254: IC5.6 37.53,18.92 36.45,17.84 36.45,12.83 38.35,10.92 38.35,5.21 X7.5
!SET_DP  (1 unrouted)
  Top 0.203: D11.C 25.39,18.29 31.3,18.29
  Top 0.254: 31.3,18.29 31.62,18.61 31.62,21.21 31.37,21.46 29.59,21.46
+5V  (via drill 0.6, 0.7)  (3 unrouted)
  Top 0.254: 11.11,1.59 10.99,1.71 10.99,5.91 13.46,8.38 13.46,8.96 R49.1 13.46,9.02 13.45,9.03 Q12.2 | C34.2 33.47,34.9 33.47,34.67 36.07,34.67 36.61,34.13 IC8.13 | 33.49,36.74 C35.2 | C28.1 50.35,25.34
  Top 0.305: 29.68,12.54 IC5.18 | X4.3 14.8,1.65 14.73,1.59 | R53.2 v21.91,22.48 | R60.2 v17.14,22.48 9.14,22.48 v8.06,23.56 | 50.35,27.24 50.35,28.64 50.1,28.89 49.47,28.89 IC6.1 | IC7.2 53.59,40.01 53.91,39.69 53.91,36.89 52.96,35.94 C31.1 | FB.P$2 5.18,41.12 v4.32,40.26 | Q10.B 7.05,64.52 v6.92,64.39
  Top 0.406: 27.18,1.59 27.1,1.66 26.3,1.66 26.23,1.59 26.16,1.52 | IC5.18 30.54,12.57 28.73,12.55 C27.1 28.73,1.61 28.7,1.59 | 33.66,36.9 C35.2 | C34.2 33.49,36.74 | 33.49,36.74 33.47,36.77 | 33.53,36.7 33.49,36.74 | 33.53,36.83 33.47,36.89 33.47,38.54 34.86,39.94 38.67,39.94 39.5,39.12 39.88,39.12 | 7.87,33.66 8.06,33.47 8.19,33.47 8.32,33.59 | R64.1 39.88,39.12 | 39.88,39.12 42.1,39.12 48.32,32.89 52.2,32.89 | 50.35,27.24 50.35,25.34 50.35,19.68 53.21,16.83 58.55,16.83 | C31.1 52.96,33.02 52.83,32.89 | X8.1 55.75,8.38 55.69,8.32 | 35.88,1.59 35.81,1.65 35.81,4.51 34.54,5.78 X7.2
  Top 0.61: 27.14,1.7 27.1,1.66 | 52.2,32.89 52.83,32.89 55.44,32.89 58.55,29.78 58.55,29.4
  Top 1.016: 58.55,29.4 58.55,16.83 58.55,10.29 56.58,8.32 55.69,8.32 54.17,8.32 47.43,1.59 35.88,1.59 28.7,1.59 27.18,1.59 26.23,1.59 14.73,1.59 11.11,1.59 9.21,1.59 8.06,2.73 v8.06,18.61 | v8.06,29.08 8.06,33.47 FB.P$2
  Bottom 0.305: v21.91,22.48 v17.14,22.48 | v4.32,40.26 2.16,40.26 1.08,41.34 1.08,60.83 2.1,61.85 6.03,61.85 6.92,62.74 v6.92,64.39
  Bottom 0.406: X6.2 6.03,31.11 v8.06,29.08
  Bottom 1.016: v8.06,29.08 v8.06,23.56 v8.06,18.61
+VREF  (via drill 0.6)  (1 unrouted)
  Top 0.254: X3.8 X3.7 52.43,20.03 52.43,28 | IC8.9 39.26,32.89 v41.53,32.89 | 52.43,28 52.43,28.45 C30.2 51.3,29.58 IC6.2 47.99,29.58 v47.75,29.34 | v52.07,27.88 52.3,27.88 52.43,28
  Top 0.305: IC7.6 58.23,38.73 58.74,38.23 58.74,36.96 57.98,36.2 C32.1 | v57.41,33.21 57.41,33.97 C32.1
  Bottom 0.254: v41.53,32.89 44.96,32.89 47.75,30.1 v47.75,29.34 | v57.41,33.21 57.41,29.4 55.88,27.88 v52.07,27.88
-9V  (via drill 0.6)
  Top 0.305: v22.99,71.12 22.99,71.5 23.69,72.2 33.08,72.2 34.92,74.04 v35.05,74.04 | v39.88,79.82 R13.2 | X2.8 9.59,50.42 10.79,51.63 10.79,53.66 17.34,60.2 v22.99,60.2
  Top 0.406: R14.2 R13.2
  Bottom 0.305: v22.99,60.2 v22.99,71.12 | v39.88,79.82 39.88,78.87 v35.05,74.04
BATT_NTC  (via drill 0.6)
  Top 0.254: IC5.14 31.24,17.65 31.69,17.21 31.69,12.19 v31.94,11.94 | X8.2 47.24,11.94 v46.04,10.73
  Bottom 0.254: v31.94,11.94 42.67,11.94 43.88,10.73 v46.04,10.73
CC_LED
  Top 0.254: R57.2 7.37,27.75 6.73,28.38 6.73,32.38 5.46,33.66 X6.1
CS_ADC  (via drill 0.6)
  Top 0.254: IC8.2 35.31,26.22 36.01,25.53 36.01,19.11 35.31,18.41 35.31,9.14 v34.92,8.76
  Bottom 0.254: X7.6 39.62,7.62 38.61,8.64 35.05,8.64 v34.92,8.76
CS_DAC  (via drill 0.6)
  Top 0.254: IC6.5 46.15,30.87 46.8,30.16 46.8,27.18 43.05,23.37 43.05,13.72 41.91,12.57 v41.91,10.29 | v37.08,10.29 X7.4
  Bottom 0.254: v41.91,10.29 v37.08,10.29
CS_EXPANDER
  Top 0.254: IC5.7 37.97,20.19 35.88,18.1 35.88,5.59 37.08,4.38 X7.3
CV_LED
  Top 0.254: 9.97,25.65 10.03,25.59 R58.1
  Top 0.305: 9.97,25.65 7.18,25.65 X6.3
DC_IN  (via drill 0.7)  (1 unrouted)
  Top 0.864: v1.65,65.47 1.65,60.64 | 1.65,60.64 2.22,60.07 2.22,60.13 X2.15 | v1.65,66.55 1.33,66.55 1.33,60.96 1.65,60.64 | v3.81,66.55 4.25,66.55 4.25,64.45 3.49,63.69 3.24,63.69 3.05,63.5 | 3.05,63.5 X2.17 | v3.81,65.47 3.81,64.96 v3.24,64.39 | v2.73,66.55 v2.73,65.47 2.73,65.41 | 2.73,65.41 2.73,63.88 | 2.73,63.88 2.73,63.82 3.05,63.5 | v2.16,64.39 2.22,64.39 2.73,63.88 | 2.73,65.41 2.79,65.47
  Top 1.27: 2.67,62.93 2.73,62.93 5.08,60.58 | X2.16 C3.1
  Top 2.184: X2.14 X2.16 5.08,60.58 X2.15 2.67,62.93 X2.17 2.67,63.25
  Bottom 0.864: 2.79,65.15 2.79,64.83 v3.24,64.39
  Bottom 3.81: Q1.D 16,94.49 2.79,81.28 2.79,65.15
DP_LED  (via drill 0.6)
  Top 0.254: Q12.3 14.17,13.03 | 14.17,13.03 v14.22,13.08 | R52.2 15.37,10.99 14.17,12.18 14.17,13.03 | v45.28,40.13 44.96,39.81 39.81,39.81 38.99,40.64 30.67,40.64 30.23,40.2 20.19,40.2 v19.75,40.64 | v45.28,67.56 44.64,68.2 44.64,71.88 37.72,78.8 R50.2
  Bottom 0.254: v45.28,40.13 v45.28,67.56 | v19.75,40.64 19.75,35.5 15.3,31.05 15.3,14.16 v14.22,13.08
GND  (via drill 0.6)  (5 unrouted)
  Top 0.254: v26.67,28.89 Q13.2 | Q14.2 v21.21,28.89 | C37.1 v37.66,38.92 | C36.1 v35.43,38.92 | v53.47,30.29 C30.1 | v25.91,10.92 C27.2 | IC8.3 IC8.4 | IC5.9 v37.4,22.73 | IC5.4 39.19,16.4 IC5.5 37.78,17.65 v37.34,17.21 | v31.5,38.1 30.99,36.39 31.5,36.89 | v31.75,33.91 31.75,34.89 C34.1 | C16.1 v38.86,74.61 | IC6.8 44.95,28.14 v44.96,28.13 | R18.1 v26.48,84.26 | v9.08,76.33 8.05,76.33 C4.2 | 37.26,26.56 IC8.5 37.26,26.12 37.34,26.04 | IC2.5 42.68,69.79 42.67,69.79 42.67,68.77 v42.55,68.52 | v15.68,39.05 14.42,39.05 R59.2 | C26.1 v16.95,35.18 | v15.62,33.4 R56.1 | v39.62,26.04 39.18,26.04 | 39.18,26.04 37.34,26.04 | 37.34,26.04 36.89,26.04 36.64,26.29 36.64,27.24 | IC8.8 39.21,26.06 39.18,26.04 | 11.49,19.3 Q11.2 v10.67,17.34 | v46.23,24.96 47.11,24.96 C28.2 | C33.2 v52.9,43.18 | 55.18,35.12 v55.18,35.88 | v50.74,37.47 IC7.4 | v48.9,35.24 49.46,35.24 C31.2
  Top 0.305: 23.69,55.94 23.62,56.01 | R22.1 v24.26,84.26 | 55.18,35.12 C32.2 | C29.1 v47.82,27.24 | R16.1 v35.12,50.16
  Top 0.406: v26.35,43.05 26.1,44.17 C21.1 | R34.1 v22.03,69.85 v22.04,69.85 | v21.97,81.03 C5.2 | C17.1 29,71.23 v29.02,71.25 | C14.2 v24.89,71.18 | v26.99,71.25 26.99,70.19 C13.1 | v23.69,54.93 23.69,55.96 C19.1 | v27.56,55.12 C20.2 | v27.5,51.24 C15.1 | R18.1 R22.1 | C22.1 v42.67,59.94 | C25.1 28.47,31.79 v28.51,31.75 | C18.1 v25.59,54.93
  Top 1.016: v17.02,53.34 v17.02,51.5 | v35.81,62.17 v37.72,62.17 | v22.48,41.27 v24.38,41.27 | v31.5,90.17 31.5,92.84 32.32,93.66 v32.32,97.03 | 46.16,56.39 v44.32,56.39 | v36.83,28.83 v36.83,30.73 | v12.45,23.62 v14.35,23.62 v16.26,23.62 | 34.23,54.93 v32.38,54.93 | v52.83,80.52 v58.29,80.52 | v37.27,74.8 v37.27,77.66 | v16.64,41.27 v18.54,41.27 | 43.75,40.83 v41.91,40.83
  Top 1.27: 4.51,55.5 2.67,57.34 | C3.2 8.32,57.02
  Top 2.184: 8.32,57.02 6.79,55.5 X2.12 4.51,55.5 2.67,55.5 2.67,57.34 SH1.1
  Bottom 0.254: v42.55,68.52 42.61,68.52 42.67,68.58
  Bottom 0.356: 12.83,98.93 25.72,98.93 27.3,97.35 | 7.75,96.01 7.75,98.11 8.57,98.93 12.83,98.93 | 12.95,96.33 12.95,98.81 12.83,98.93
  Bottom 0.61: X3.5 X3.6
  Bottom 0.813: 9.14,76.39 v9.08,76.33 v9.08,75.37 | 22.1,69.79 v22.04,69.85
  Bottom 2.184: 2.67,58.29 SH1.1 2.67,55.24
  other vias: 46.23,56.39 34.29,54.93 43.81,40.83
  pour Bottom (isolate 0.305, rank 2): 0,100.01 60.01,100.01 60.01,0 0,0
HOLE_DL2  (via drill 3.2 pad 5.5)
  other vias: 4,4
HOLE_DR2  (via drill 3.2 pad 5.5)
  other vias: 56,4
HOLE_UL2  (via drill 3.2 pad 5.5)
  other vias: 4,96
HOLE_UR2  (via drill 3.2 pad 5.5)
  other vias: 56,96
I_MON  (via drill 0.6)
  Top 0.254: IC3.6 27.11,65.57 27.11,66.48 27.56,66.93 29.33,66.93 R43.2 | 29.97,66.29 R43.2 | 32.44,66.1 R39.1 31.5,66.11 | 31.5,66.11 31.5,66.1 | 31.5,66.11 31.43,66.11 | 31.43,66.11 30.17,66.11 R43.2 | 31.43,66.11 31.43,63.25 32.07,62.61 v32.83,62.61 | v31.69,39.62 30.29,38.23 30.29,31.18 v31.69,29.78 | IC8.7 38.56,29.22 v38.86,29.53
  Bottom 0.254: 38.61,29.78 v31.69,29.78 | v32.83,62.61 32.83,60.13 33.34,59.63 33.34,41.27 v31.69,39.62
  Bottom 0.305: v38.86,29.53 38.61,29.78
I_SERVO  (via drill 0.6)
  Top 0.254: 35.08,69.2 D7.C | D8.A D7.C | 34.73,66.6 D8.A | v34.61,61.21 33.02,61.21 R63.1 | v34.54,65.47 34.54,66.41 D8.A | IC2.1 38.74,67.69 37.34,69.09 37.21,69.09 C23.2 35.36,69.47 D7.C
  Bottom 0.254: v34.61,61.21 34.61,65.41 v34.54,65.47
I_SET  (via drill 0.6)
  Top 0.254: 40,59.63 R36.1 | X3.4 56.33,23.88 57.59,25.15 57.59,29.65 55.37,31.88 v51.05,31.88 | 40,59.63 39.18,59.63 | 40,59.63 v40.64,59.63
  Bottom 0.254: v51.05,31.88 50.93,31.88 42.86,39.94 42.86,57.4 v40.64,59.63
I_SET_IN
  Top 0.254: 49.45,30.24 49.4,30.29 | 49.47,30.23 48.32,30.23 46.48,32.07 43.05,32.07 41.47,30.48 38.48,30.48 37.91,29.91 IC8.6 | IC6.3 49.45,30.24 | 49.45,30.24 49.47,30.23 | X3.2 56.33,29.97 55.12,31.18 52.32,31.18 51.37,30.23 49.47,30.23
INT_EXP  (via drill 0.6)
  Top 0.254: v40.89,21.46 IC5.8 | v44.07,21.46 44.45,21.08 48.32,21.08 49.21,20.19 49.21,16.32 47.62,14.73 47.05,14.73 JP1.4
  Bottom 0.254: v40.89,21.46 v44.07,21.46
ISENSE+  (via drill 0.6)  (2 unrouted)
  Top 0.254: 27.05,60.23 IC3.3 v27.06,61.84 v27.05,61.85 | R37.2 R35.2 | v25.46,63.44 24.89,64.01 22.61,64.01 R37.2
  Bottom 0.254: v27.05,61.85 v25.46,63.44
ISENSE-
  Top 0.254: IC3.2 25.78,60.23 25.78,61.47 | R41.2 23.05,61.47 25.78,61.47 | 29.78,60.52 30.16,60.52 | 30.16,60.52 30.23,60.58 | 25.78,61.47 25.78,61.98 26.67,62.87 27.37,62.87 29.84,60.39 30.04,60.39 R44.1 30.16,60.52
N$1
  Top 0.406: Q6.3 44.09,82.08 43.05,83.12 R14.1
N$2
  Top 0.305: R5.2 40.2,90.67 39.81,91.06 37.08,91.06 35.63,89.6 Q2.B
N$3
  Top 0.254: C6.2 R17.1
N$4  (via drill 0.6)
  Top 0.254: v22.73,14.73 D10.C | X4.2 12.26,4.83 13.72,6.29 20.32,6.29 22.16,8.13 v22.16,8.95
  Bottom 0.254: v22.73,14.73 22.73,9.53 v22.16,8.95
N$5  (via drill 0.6)  (1 unrouted)
  Top 0.254: v18.16,8.64 18.16,10.6 R52.1
  Bottom 0.254: X5.1 19.88,6.54 v18.16,8.64
N$6  (via drill 0.6)  (2 unrouted)
  Top 0.254: X5.3 24.96,7.68 21.97,10.67 v20.19,10.67 | Q12.1 11.57,11.25 | v19.81,14.73 19.81,16.32 20.77,17.27 D11.A | v12.32,10.79 11.62,10.79 | 11.62,10.79 11.56,10.86 | 11.62,10.79 R49.2 11.62,8.89
  Bottom 0.254: v12.32,10.79 20.07,10.79 v20.19,10.67 19.81,11.05 v19.81,14.73
N$7
  Top 0.254: Q13.3 19.3,27.88 18.48,27.05 14.41,27.05 12.95,25.59 R58.2
N$8
  Top 0.254: R37.1 R38.2
N$9  (via drill 0.6)
  Top 0.254: R47.1 18.16,13.21 18.16,13.14 19.18,12.13 19.18,8.32 18.16,7.3 v16.57,7.3
  Bottom 0.254: X4.4 17.34,4.7 16.76,5.27 16.76,7.11 v16.57,7.3
N$10
  Top 0.254: R33.1 C12.2
N$11  (1 unrouted)
  Top 0.254: IC7.5 55.82,37.47 55.44,37.85 55.44,42.8 55.88,43.24
N$12
  Top 1.016: X2.2 8.04,42.8 FB.P$1
N$13
  Top 0.254: R41.1 R42.2
N$14
  Top 0.254: R43.1 R44.2
N$15  (1 unrouted)
  Top 0.254: R35.1 | R35.1 R34.2
N$16  (1 unrouted)
  Top 0.254: IC2.6 40.13,69.76 40.13,69.79
N$17
  Top 0.254: R31.1 45.34,46.29 44.9,46.74 41.91,46.74 41.21,46.04 C9.1 R30.2
N$18  (1 unrouted)
  Top 0.254: C10.2 19.94,49.47 20,49.53
N$22  (1 unrouted)
  Top 0.254: C24.2 R46.1 44.83,64.07
N$26
  Top 0.254: C7.2 R19.1
N$27
  Top 0.254: C11.2 36.2,52.96 36.83,53.59 37.85,53.59 38.48,54.23 38.48,54.8 R29.1
N$28
  Top 0.254: 12,27.69 R57.1 12.06,27.88 Q14.3
N$29  (1 unrouted)
  Top 0.254: 36.26,43.37 36.2,43.43 36.2,43.75 33.02,43.75 33.09,43.82 R23.2 33.02,44.32 27.88,44.32 25.21,46.98 IC1.3
N$32
  Top 0.254: IC1.2 25.71,48.26 26.29,48.83 26.29,51.63 27.05,52.39 29.4,52.39 30.61,53.59 33.08,53.59 | 33.08,53.59 33.08,53.66 33.27,53.85 35.63,53.85 R29.2 | 33.08,53.59 R25.2 | IC1.2 | D6.C 22.15,47.25 C10.1 21.84,48 21.97,48.13 24.48,48.13 IC1.2
N$37  (4 unrouted)
  Top 0.254: R45.2 36.64,63.69 34.92,63.69 34.86,63.75 D8.C 34.73,63.82 33.27,63.82 32.77,63.69 32.77,64.2 | IC2.2 40.14,63.51 39.75,63.12 36.89,63.12 36.89,63.63 36.83,63.69 | R46.2 44.9,66.23 44.96,66.29 40.83,66.29 40.13,65.6 40.13,64.71 40.2,64.64
N$42
  Top 0.254: 35.56,36.04 C36.2 37.37,36.17 C37.2 | R64.2 C37.2 | IC8.12 37.26,35.48 C37.2
N$44
  Top 0.305: Q9.B 30.98,83.06 29.15,81.22 R8.1
  Top 0.406: R18.2 R8.1
N$45  (via drill 0.6)  (2 unrouted)
  Top 0.254: IC4.2 IC4.1 | R55.1 | v22.8,31.05 24.64,31.05 24.7,30.99 | 23.05,24.7 22.99,24.77 22.99,25.84 v22.73,25.91
  Bottom 0.254: v22.73,25.91 22.73,30.99 v22.8,31.05
N$48  (via drill 0.6)
  Top 0.254: IC4.13 IC4.14 v17.97,31.05 | R62.1 17.53,25.4 v17.53,26.1
  Bottom 0.254: v17.53,26.1 17.53,30.61 v17.97,31.05
N$50  (1 unrouted)
  Top 0.254: IC2.3 41.41,63.44 39.56,61.59
N$54  (via drill 0.6)  (1 unrouted)
  Top 0.254: R24.1 36.32,80.33 36.32,73.15 v36.77,72.71 36.45,72.39 35.24,72.39 34.8,71.94 D7.A | v36.77,57.02 36.39,56.64 31.56,56.64 28.45,53.53 23.24,53.53 22.21,52.5 D5.A
  Top 0.305: 35.37,81.16 R24.1
  Bottom 0.305: v36.77,57.02 v36.77,72.71
N$56
  Top 0.406: Q1.G 11.05,96.08 14.4,92.72 D1.C R3.1 | R3.1 | D2.A 23.32,87.89 23.18,87.76 19.24,87.76 18.73,88.27 18.73,91.12 R3.1
N$62
  Top 0.406: Q4.3 11.77,91.23 D1.A
N$63  (via drill 0.6)
  Top 0.254: IC5.10 v31.88,22.73
  Bottom 0.254: v31.88,22.73 35.18,22.73 36.2,23.75 42.1,23.75 42.67,23.18 46.1,23.18 JP1.1
N$65
  Top 0.305: R15.1 R12.2
  Top 0.406: Q4.1 17.62,84.43 R12.2 | R12.2 | D4.A 17.27,86.61 17.34,86.55 17.34,84.71 17.65,84.39 17.66,84.39 R12.2
N$67
  Top 0.305: R12.1 21.84,84.2 C5.1
N$117  (1 unrouted)
  Top 0.254: R21.1 R20.2 C8.1
N$129  (1 unrouted)
  Top 0.406: 24.7,90.11 24.77,90.04 24.77,86.93 24.45,86.61 D4.C 19.05,86.61 17.03,88.63 ZD1.C 17.03,88.82
N$143
  Top 0.406: D2.C 27.51,87.95 ZD3.C
N$145
  Top 0.254: R24.2 32.45,83.12 32.13,82.8 32.13,82.25 Q9.E
N$146
  Top 0.254: 42.74,89.79 R5.1 42.1,90.05 | 39.63,96.46 Q5.S
  Top 0.406: 42.1,90.05 R6.1 42.1,96.33 42.23,96.46
  Top 1.676: R2.1 42.8,96.46 42.23,96.46 39.63,96.46 39.62,96.46
N$147  (1 unrouted)
  Top 0.406: 37.72,93.92 39.43,93.92 40.2,93.15 R6.2 | 37.72,93.92 34.48,93.92 | 34.48,93.92 34.35,93.92 33.4,92.96 33.4,90.55 | D3.A 37.78,93.85 37.72,93.92 | Q5.G 34.46,93.94 34.48,93.92
N$149
  Top 0.61: C2.2 52.01,75.86 52.01,77.15 51.75,77.15 R7.2
N$150  (via drill 0.6)
  Top 0.254: R20.1 v40.13,50.16 R16.2 38.1,49.21 37.72,48.83 36.64,48.83 34.04,46.23 32,46.23 31.49,45.72 IC1.5 | v40.96,56.07 40.96,55.12 R17.2
  Bottom 0.254: v40.13,50.16 40.13,55.24 v40.96,56.07
N$153  (via drill 0.6)
  Top 0.254: IC4.6 24.76,36.77 | 24.76,36.77 IC4.5 | R51.2 v23.18,43.62 | v22.92,36.77 24.76,36.77
  Bottom 0.254: v22.92,36.77 23.43,37.15 23.43,43.12 v23.18,43.62
N$158  (3 unrouted)
  Top 0.254: 36.2,46.04 36.2,45.91 | 36.2,45.4 36.26,45.47 | 35.82,45.15 R30.1 36.2,45.91 | R26.2 32.57,47.3 31.81,47.3 31.5,46.99 IC1.6 29.02,46.98 28.45,46.42 28.45,45.34 28.96,44.83 31.56,44.83 32.13,45.4 36.07,45.4 R30.1 | 36.2,45.91 37.21,46.93 40.58,46.93 41.21,47.56 41.21,47.88 41.15,47.94
N$161  (via drill 0.6)
  Top 0.254: v21.53,38.67 IC4.8 v17.97,38.67 | 32.83,59.05 32.7,59.05 | 32.7,59.05 30.73,59.05 28.57,56.9 28.57,54.67 27.94,54.04 18.86,54.04 17.97,53.15 17.97,43.75 v17.65,43.43 | IC4.11 21.08,34.86 v21.21,34.73 | R63.2 32.7,59.06 32.7,59.05
  Bottom 0.254: v21.21,34.73 21.21,38.48 v21.53,38.67 | v17.97,38.67 17.59,39.05 17.59,43.37 v17.65,43.43
N$170
  Top 0.254: IC4.7 23.43,38.67 22.16,37.4 IC4.9 17.4,37.4 15.3,35.3 R56.2 R54.1
N$172  (1 unrouted)
  Top 0.254: C23.1 R45.1
N$177  (1 unrouted)
  Top 0.254: IC4.4 23.5,34.86 22.23,36.13 IC4.10 | 24.83,34.8 24.89,34.86 26.04,34.86 26.67,35.5 26.67,38.92 25.97,39.62 17.59,39.62 15.12,37.15 R59.1 R61.2
N$183  (2 unrouted)
  Top 0.406: R11.1 | Q8.E 13.4,73.79 13.08,74.11
N$184
  Top 0.406: Q7.E R10.1
N$186
  Top 0.305: R27.2 10.37,70.61 Q10.E
N$201  (1 unrouted)
  Top 0.406: Q3.B 27.41,92.29 27.88,91.82 27.88,91.89
OE_DRIVE  (via drill 0.6)
  Top 0.254: Q11.3 12.7,15.37 v13.4,15.37 14.67,15.37 15.88,14.16 R47.2 | 13.02,71.18 12.89,71.05 R27.1 16.32,70.61 v17.21,69.72 | v14.61,43.5 14.61,52.32 v17.21,54.93
  Bottom 0.254: v17.21,54.93 v17.21,69.72 | v13.4,15.37 13.4,42.29 v14.61,43.5
OUT+  (via drill 0.6)
  Top 0.254: 41.21,52.9 C8.2 | C8.2 | C8.2 39.81,52.33 | 39.81,52.33 38.1,52.33 C11.1 | R9.1 45.34,52.77 44.58,53.53 39.81,53.53 | 39.81,53.53 39.81,52.33 | C24.1 49.08,62.55 43.69,57.15 40.58,57.15 39.81,56.39 39.81,56.07 | 39.81,53.53 39.81,56.07 | 39.81,56.07 31.81,56.07 28.7,52.96 24.57,52.96 v24,52.39 | X2.9 3.94,51.69 9.08,51.69 v9.78,52.39
  Top 0.305: C24.1 49.08,66.54 49.85,67.31
  Top 0.406: Q2.E 35.58,92.56 v35.56,92.58 | v55.94,78.99 v56.9,78.99 56.9,77.23 C2.1 | R1.1 29.46,95.95 27.18,93.66 24.77,93.66 23.94,92.84 23.94,92.41 Q3.E
  Top 1.27: C1.1.1 C1.1 49.85,67.31 X1.P$1
  Top 2.54: ZD2.C 57.41,69.67 X1.P$1
  Bottom 0.254: v9.78,52.39 v24,52.39
  Bottom 0.406: v35.56,92.58 34.42,93.09 34.35,93.15 33.78,92.58 | 30.04,95.5 R1.1 | 55.56,77.98 v55.94,78.99 55.44,77.98 55.56,78.11
  Bottom 0.813: R2.2 45.59,92.39 45.66,92.33
  Bottom 3.81: 30.04,95.5 32.96,92.58 33.78,92.58 45.4,92.58 45.66,92.33 55.56,82.42 55.56,78.11 55.56,67.82 X1.P$1
OUT-  (via drill 0.6, 0.7)  (1 unrouted)
  Top 0.254: R40.1 12.19,64.77 12.51,64.45 16.07,64.45 R38.1 | 43.11,44.38 C7.1 R32.2 45.34,42.48 45.78,42.04 49.02,42.04 58.48,51.5 58.48,58.86 55.05,62.29 X1.P$2 | 43.11,44.38 43.12,44.39 | 43.11,44.38 C9.2
  Top 0.406: R40.1 12.19,66.99 v11.68,67.5 v10.73,67.5 v10.73,68.45 | v11.68,68.45 v12.64,68.45 | R7.1 48.39,79.75 v48.39,80.26
  Top 0.813: ZD2.A v50.93,72.71 | v50.93,72.71 v50.93,71.63 | v50.93,72.71 v50.93,73.79
  Top 1.016: C1.2 C1.2.1
  Bottom 0.406: v13.59,68.45 v12.64,68.45 v12.64,67.5 | v13.59,67.5 v12.64,67.5 | v12.64,67.5 v11.68,67.5 | v10.73,67.5 10.92,67.5 | v11.68,68.45 12.51,70.8 | v10.73,68.45 10.73,68.52 10.76,73.06 | v48.39,80.26 49.15,79.76 49.59,80.2
  Bottom 0.813: v50.93,73.79 49.59,73.79
  Bottom 1.016: C1.2.1 49.02,74.42 49.59,74.99
  Bottom 3.81: 12.19,68.83 12.19,82.17 12.32,82.17 12.32,82.36 17.4,87.44 43.62,87.44 49.59,81.47 49.59,80.2 49.59,74.99 49.59,73.79 49.59,65.34 52.62,62.31 X1.P$2
POUT-
  Top 0.254: 16.13,62.36 16.19,62.29 | R40.2 12.19,61.85 12.51,62.17 15.94,62.17 16.13,62.36 | 16.13,62.36 16.13,62.42 R42.1
  Top 1.27: R40.2 12.19,59.24 | X2.11 2.73,55.56 4.7,53.59 4.89,53.53 | 4.89,53.53 5.71,54.36 | X2.10 5.21,53.21 4.89,53.53
  Top 2.184: X2.11 X2.13
  Top 3.81: 12.19,59.24 7.24,54.29 5.78,54.29 5.71,54.36
PREG_EN  (1 unrouted)
  Top 0.254: X4.1 9.84,4.38 9.84,10.67 11.75,12.57 11.75,16 12.45,16.7 13.53,16.7 | 13.53,16.7 Q11.1 13.53,19.24 R48.2 | D9.C 20.26,12.89 16.45,16.7 13.53,16.7 | X2.5 1.08,46.29 1.08,26.8 7.3,20.57 12.89,20.57 13.4,20.07 R48.2
PS_MISO  (via drill 0.6)
  Top 0.254: IC8.15 35.31,31.62 33.47,29.78 33.47,16.95 v34.35,16.07 | 39.13,15.05 IC5.3 | 39.26,15.18 IC5.3 | v40.96,15.11 IC5.3 | X7.9 43.5,5.14 43.5,11.37 v44.7,12.57
  Bottom 0.254: v34.35,16.07 40.26,16.07 41.21,15.11 | v40.96,15.11 41.21,15.11 | 41.21,15.11 42.16,15.11 v44.7,12.57
PS_MOSI  (via drill 0.6)
  Top 0.254: IC8.16 34.66,31.8 32.89,30.04 v32.89,13.91 32.89,5.59 X7.1 | v37.4,13.84 IC5.2 41.08,13.84 41.85,14.61 41.85,24.89 43.43,26.48 43.43,29.21 43.81,29.59 44.93,29.59 IC6.7
  Bottom 0.254: v37.4,13.84 32.96,13.84 v32.89,13.91
PS_SCLK  (via drill 0.6)
  Top 0.254: IC8.1 34.67,27.86 34.67,25.46 v35.05,25.08 | IC6.6 44.96,30.23 45.97,30.23 46.23,29.91 46.23,27.94 v43.43,25.08 42.42,24.07 42.42,14.03 40.89,12.51 | X7.7 40.89,5.21 40.89,12.51 | 40.89,12.51 39.26,12.51 IC5.1
  Bottom 0.254: v35.05,25.08 v43.43,25.08
PWRGOOD
  Top 0.254: IC5.16 26.99,15.11 26.61,14.73 D10.A 22.92,16.18 22.92,17.91 21.84,18.99 18.54,18.99 16.38,21.14 7.62,21.14 1.65,27.11 1.65,41.78 X2.1
Q4_OUT  (2 unrouted)
  Top 0.406: Q1.S 21.21,95.7 21.27,95.64 21.27,94.74 20.25,93.72 R3.2 20.43,91.33 ZD1.A | 30.86,96.71 30.04,97.54 26.86,97.54 R1.2 | R8.2 28.95,83.12 29.78,83.95 29.71,84.01 R4.2 | 29.84,92.2 29.78,92.27 29.78,93.92 30.86,95 30.86,96.65
  Top 3.81: Q1.S 25.4,96.08 R1.2
Q6C
  Top 0.406: 42.86,87.38 37.78,87.38 | D3.C 37.78,87.38 | 37.78,87.38 32.05,87.38 ZD3.A
  pour Top (isolate 0.305): 59.05,80.96 42.42,80.96 42.42,95.25 59.05,95.25
Q7C  (via drill 0.6)  (2 unrouted)
  Top 0.305: 17.34,79.18 17.34,77.22 16.76,76.64 v15.68,76.64 15.66,76.62 Q8.B | 17.34,79.18 17.34,79.5 17.27,79.57 | Q7.C 17.4,79.12 17.34,79.18 | v15.68,72.45 9.02,72.45 8,71.44
  Top 0.406: 17.27,79.57 16.83,80.01 15.68,80.01 15.62,80.07
  Bottom 0.305: v15.68,72.45 v15.68,76.64
Q8C
  Top 0.305: 25.65,79.57 25.72,79.5 | R15.2 19.75,79.56 19.68,79.5
  Top 0.406: R22.2 24.26,79.44 24.32,79.38 | Q9.C 33.23,79.27 33.21,79.25
  pour Top (isolate 0.305, no thermals): 15.88,71.44 15.88,77.15 17.78,77.15 17.78,79.69 35.88,79.69 35.88,71.44
SENSE+  (3 unrouted)
  Top 0.254: R21.2 R9.2 | R9.2 47.18,52.39 | R9.2 C6.1
  Top 0.305: 47.18,52.26 48.32,52.26 53.37,57.31 X1.P$3
SENSE-
  Top 0.254: R32.1 R31.2 C12.1 50.76,48.02 X1.P$4
SET_OE
  Top 0.254: IC5.17 27.56,13.84 26.61,12.89 D9.A
TEMP_FREQ  (1 unrouted)
  Top 0.254: 29.59,18.99 29.65,18.92 22.92,18.92 22.29,19.56 18.73,19.56 16.57,21.72 7.94,21.72 2.22,27.43 2.22,39.81 3.94,41.53 3.94,44.39 2.98,45.34 X2.3 | 29.52,19.05 IC5.13
U_MON  (via drill 0.6)  (1 unrouted)
  Top 0.254: R25.1 R26.1 32.64,49.28 31.81,49.28 30.79,48.26 IC1.7 28.95,48.26 v28.57,47.88 | v41.59,37.47 41.59,35.37 40.96,34.73 38.86,34.73 38.54,34.42 38.54,32.89 | v40.32,40.83 39.94,41.21 30.42,41.21 v28.57,43.05
  Bottom 0.254: v28.57,47.88 v28.57,43.05 | v40.32,40.83 40.32,38.73 v41.59,37.47
U_SERVO
  Top 0.254: IC1.1 24.57,49.56 24.03,49.56 24,49.53 R28.2 21.84,49.91 20.37,51.38 19.31,51.38 | 19.75,43.69 19.75,43.5 | R51.1 19.75,43.69 | 19.75,43.69 19.75,45.1 D6.A 18.67,46.17 18.67,50.74 19.31,51.38 | D5.C 19.31,51.38
U_SET  (via drill 0.6)  (1 unrouted)
  Top 0.254: v55.05,29.53 55.05,25.02 X3.3 | R23.1 33.47,41.97 44.9,41.97 49.21,37.66 v49.21,36.96
  Bottom 0.254: 55.05,29.59 v55.05,29.53 55.05,31.11 v49.21,36.96
U_SET_IN  (via drill 0.6)
  Top 0.254: 49.4,30.89 IC6.4 | 37.91,32.32 IC8.11 37.91,31.82 38.1,31.62 41.72,31.62 42.74,32.64 46.93,32.64 47.94,31.62 v48.77,31.62 48.77,30.87 IC6.4 | IC6.4 49.4,30.86
  Bottom 0.254: X3.1 51.44,25.97 49.66,27.75 49.66,30.73 v48.77,31.62
V+  (via drill 0.6, 0.7)  (4 unrouted)
  Top 0.305: 25.18,68.58 C14.1 | 25.78,65.63 IC3.7 | 12.25,33.59 R54.2
  Top 0.406: IC4.3 26.61,33.59 | 26.61,33.59 27.22,33.59 27.32,33.49 C25.2 | IC1.8 29.97,49.53 | IC1.8 30.04,49.53 30.25,49.74 C15.2 30.25,51.33 | IC1.8 | 26.64,68.58 C13.2 26.96,68.42 27.11,68.58 | 25.18,68.58 26.99,68.58 | 26.99,68.58 27.11,68.58 | 27.11,68.58 29.02,68.58 | 29.02,68.58 29.14,68.58 29.15,68.58 | 26.97,68.57 26.99,68.58 | 29.08,68.58 29.02,68.58 | IC2.8 38.74,71.66 C16.2 | 26.61,33.59 26.54,33.53 26.54,30.54 25.97,29.97 v11.75,29.97 | v31.05,69.79 31.5,70.23 35.31,70.23 36.64,71.56 38.8,71.56 38.86,71.63 | v31.05,68.58 29.34,68.58 C17.2 29.15,68.39 29.15,68.52 | R54.2 v10.99,33.4 | v31.37,52.39 30.29,51.31 | 25.78,68.58 25.04,68.58 C14.1 24.89,67.56 25.78,66.67 25.78,65.63
  Top 0.61: 29.08,68.58 C17.2 | 29.27,68.39 29.15,68.52 | 38.73,71.63 38.86,71.75
  Top 0.813: 11.75,47.88 11.75,53.21 15.88,57.34 20.19,57.34 v21.08,58.23
  Top 1.016: v11.75,43.5 11.75,47.88 X2.6
  Bottom 0.254: 31.3,58.17 31.05,58.17 30.99,58.23
  Bottom 0.406: v11.75,29.97 11.68,29.78 | 31.3,58.17 31.37,58.1 v31.37,52.39 | v10.99,33.4 11.75,33.4
  Bottom 0.61: v31.05,68.58 v31.05,69.79 | 30.99,58.23 30.99,68.58
  Bottom 0.813: v21.08,58.23 30.99,58.23
  Bottom 1.016: v11.75,43.5 11.75,33.4 v11.75,29.97
V-  (via drill 0.7)  (4 unrouted)
  Top 0.254: 19.54,33.62 IC4.12 | C19.2 23.62,57.91 | C18.2 25.28,57.91 25.27,57.91 | R61.1 9.71,39.24 9.65,39.18 | 28.33,60.19 IC3.4
  Top 0.305: 25.27,57.85 25.27,57.91 | 28.36,60.26 IC3.4 | 27.6,57.79 C20.1 | 28.33,60.19 28.32,60.2
  Top 0.406: IC1.4 24.45,45.56 24.45,44.01 | C20.1 27.62,57.78 | 17.63,32.93 18.31,33.62 19.54,33.62 | IC3.4 28.33,58.64 C20.1 | C19.2 C18.2 | C18.2 25.78,57.91 | C18.2 27.52,57.91 C20.1 | 23.62,57.91 22.86,57.91 21.91,57.15 v21.91,56.2 | 9.78,42.35 9.78,42.42 | 9.78,42.35 9.78,42.29 23.5,42.29 24.45,43.24 24.45,44.01 | 9.78,42.35 9.72,42.29 9.65,42.23 9.65,39.18 9.65,33.27 10.86,32.07 16.95,32.07 C26.2 17.12,32.42 17.59,32.89 | C21.2 24.45,44.01 | 42.65,62.87 42.16,62.87 41.66,62.36 41.66,59.12 40.7,58.17 35.43,58.17 34.8,57.53 30.92,57.53 v29.59,56.2 | C22.2 42.67,64.39
  Top 0.61: 42.65,62.87 C22.2 | C19.2
  Top 0.813: 21.78,56.2 v21.91,56.2 16.32,56.2 | v13.27,45.66 13.27,53.15 16.26,56.13
  Top 1.016: 9.72,42.29 9.72,43.94 8.32,45.34 X2.4
  Bottom 0.61: v21.91,56.2 v29.59,56.2
  Bottom 0.813: v13.27,45.66 5.59,45.66 5.27,45.34
VBIAS  (1 unrouted)
  Top 0.254: 3.75,74.36 3.75,75.88 3.81,75.95
  Top 0.406: 3.75,74.36 3.81,74.3 3.81,71.88 5.46,70.23 5.46,63.31 5.14,62.99
  pour Top (isolate 0.406): 0.95,92.58 10.16,92.58 10.16,90.17 13.97,90.17 13.97,73.41 1.02,73.41

### Text on the board
Bottom: EEZ post-regulator | (10/2015 r4B44)
tPlace: Out+ | Out- | S+ | S- | LED CV/CC | + | POTS | SPI | (10/2015 r4B44) | EEZ Post-regulator | OE | DP | off | Temp in
tDocu: Licensed under the TAPR Open Hardware License (www.tapr.org/OHL)
_tNames: R1 | R2 | R3 | R4 | Q5 | R6 | Q1 | D1 | Q2 | ZD1 | Q3 | R5 | Q6 | ZD3 | D3 | D4 | D2 | R12 | C5 | R22 | R8 | Q9 | R50 | R14 | R15 | Q4 | R10 | Q7 | R18 | R24 | R13 | R7 | C2 | C4 | ZD2 | R11 | C1 | Q8 | C16 | D7 | R27 | Q10 | C14 | C13 | C17 | C23 | IC2 | R34 | R35 | R43 | R39 | R46 | R40 | R38 | C24 | R37 | R45 | C3 | D8 | R42 | R41 | IC3 | C22 | R44 | R36 | R63 | R29 | R17 | C6 | R25 | C19 | C18 | C20 | D5 | C15 | C8 | R9 | C11 | R28 | IC1 | R21 | R20 | C10 | R16 | C12 | X1 | R30 | R33 | D6 | R26 | C9 | R31 | FB | R51 | C33 | C21 | R19 | C7 | R32 | R61 | R59 | R23 | IC4 | C36 | C37 | IC7 | C35 | R64 | C31 | C32 | X6 | C26 | C25 | C34 | IC6 | R54 | R56 | C30 | R57 | IC8 | Q14 | C29 | Q13 | R62 | C28 | R58 | R55 | IC5 | X3 | R60 | R53 | R48 | D11 | Q11 | R47 | D10 | D9 | JP1 | Q12 | R49 | C27 | R52 | X8 | X7 | X5